# Altium schematic sheet 0095_CONNECTIVITY - GBI.SchDoc
size 848 x 558 mm
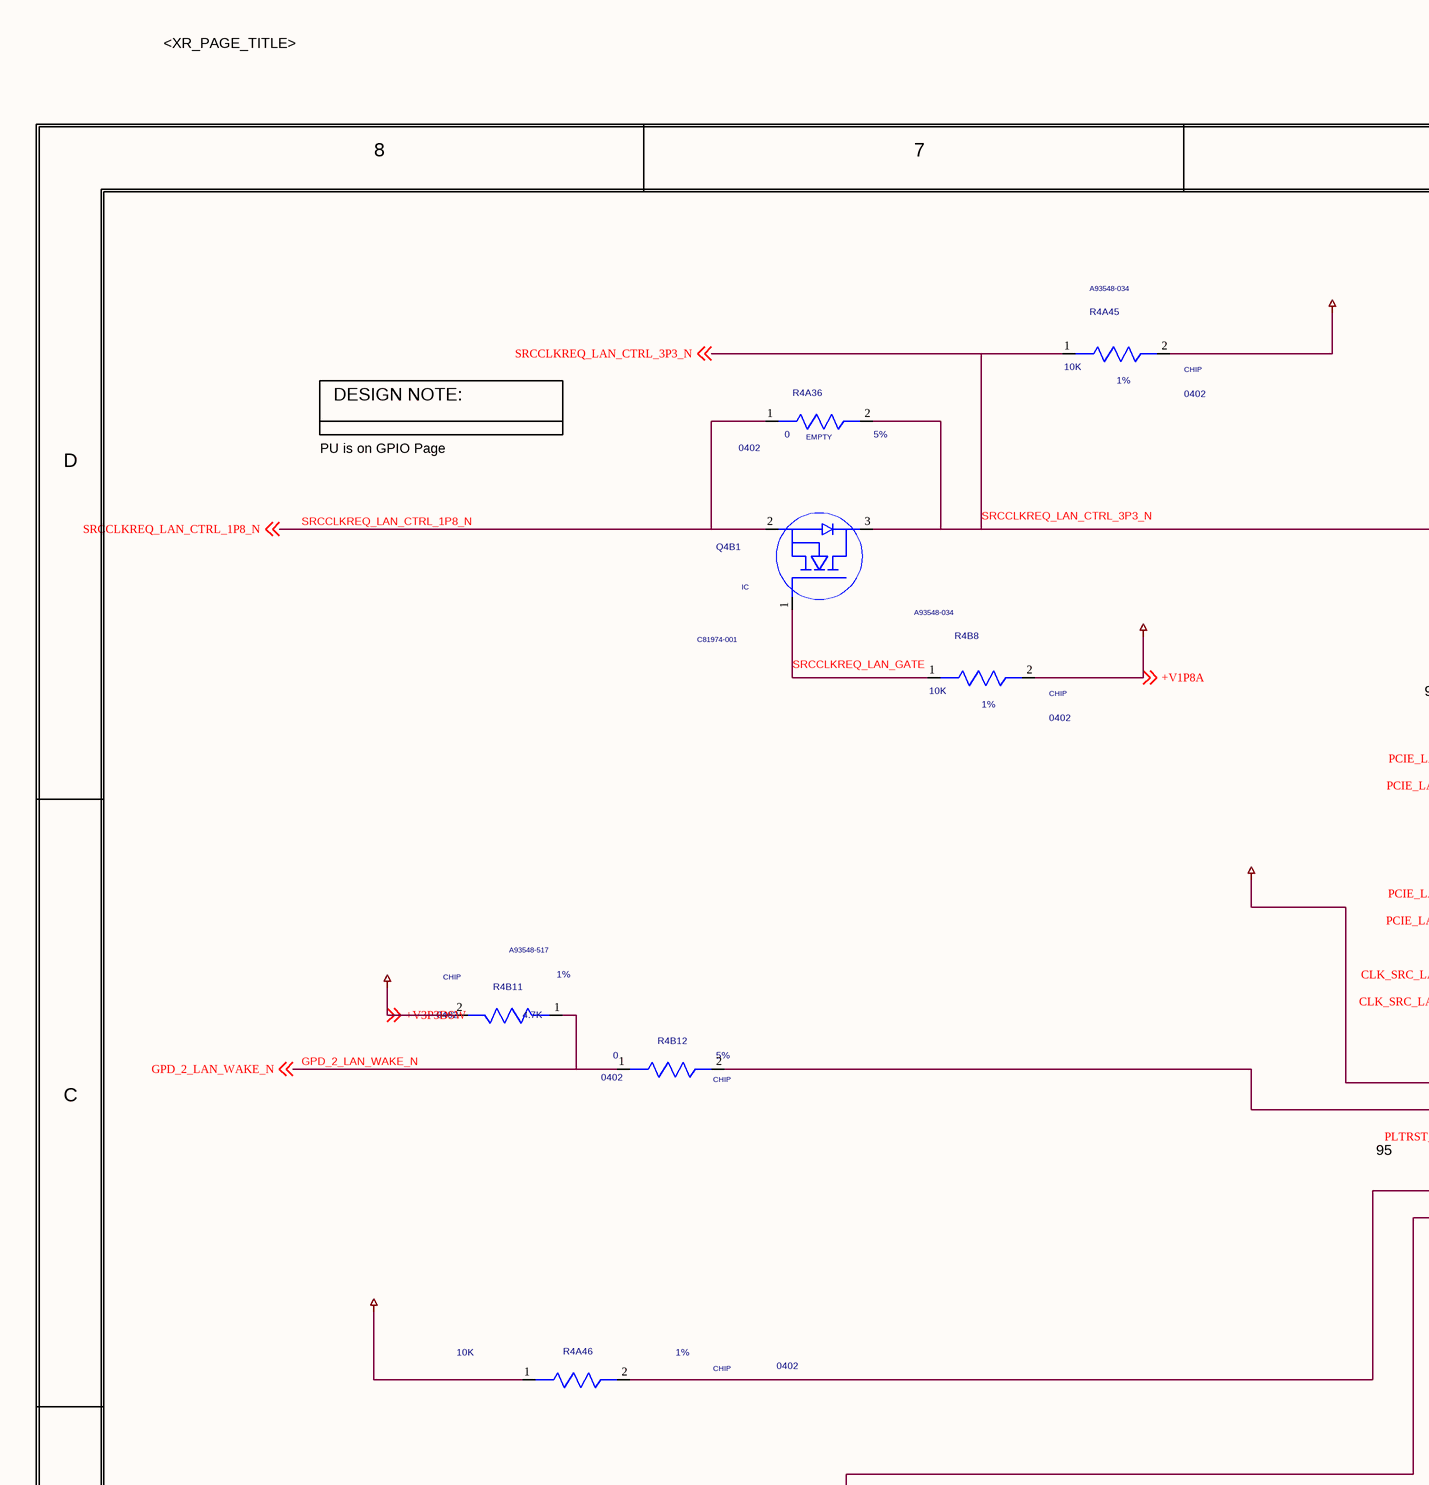
[diagram p0: 0095_CONNECTIVITY - GBI.SchDoc, top left]
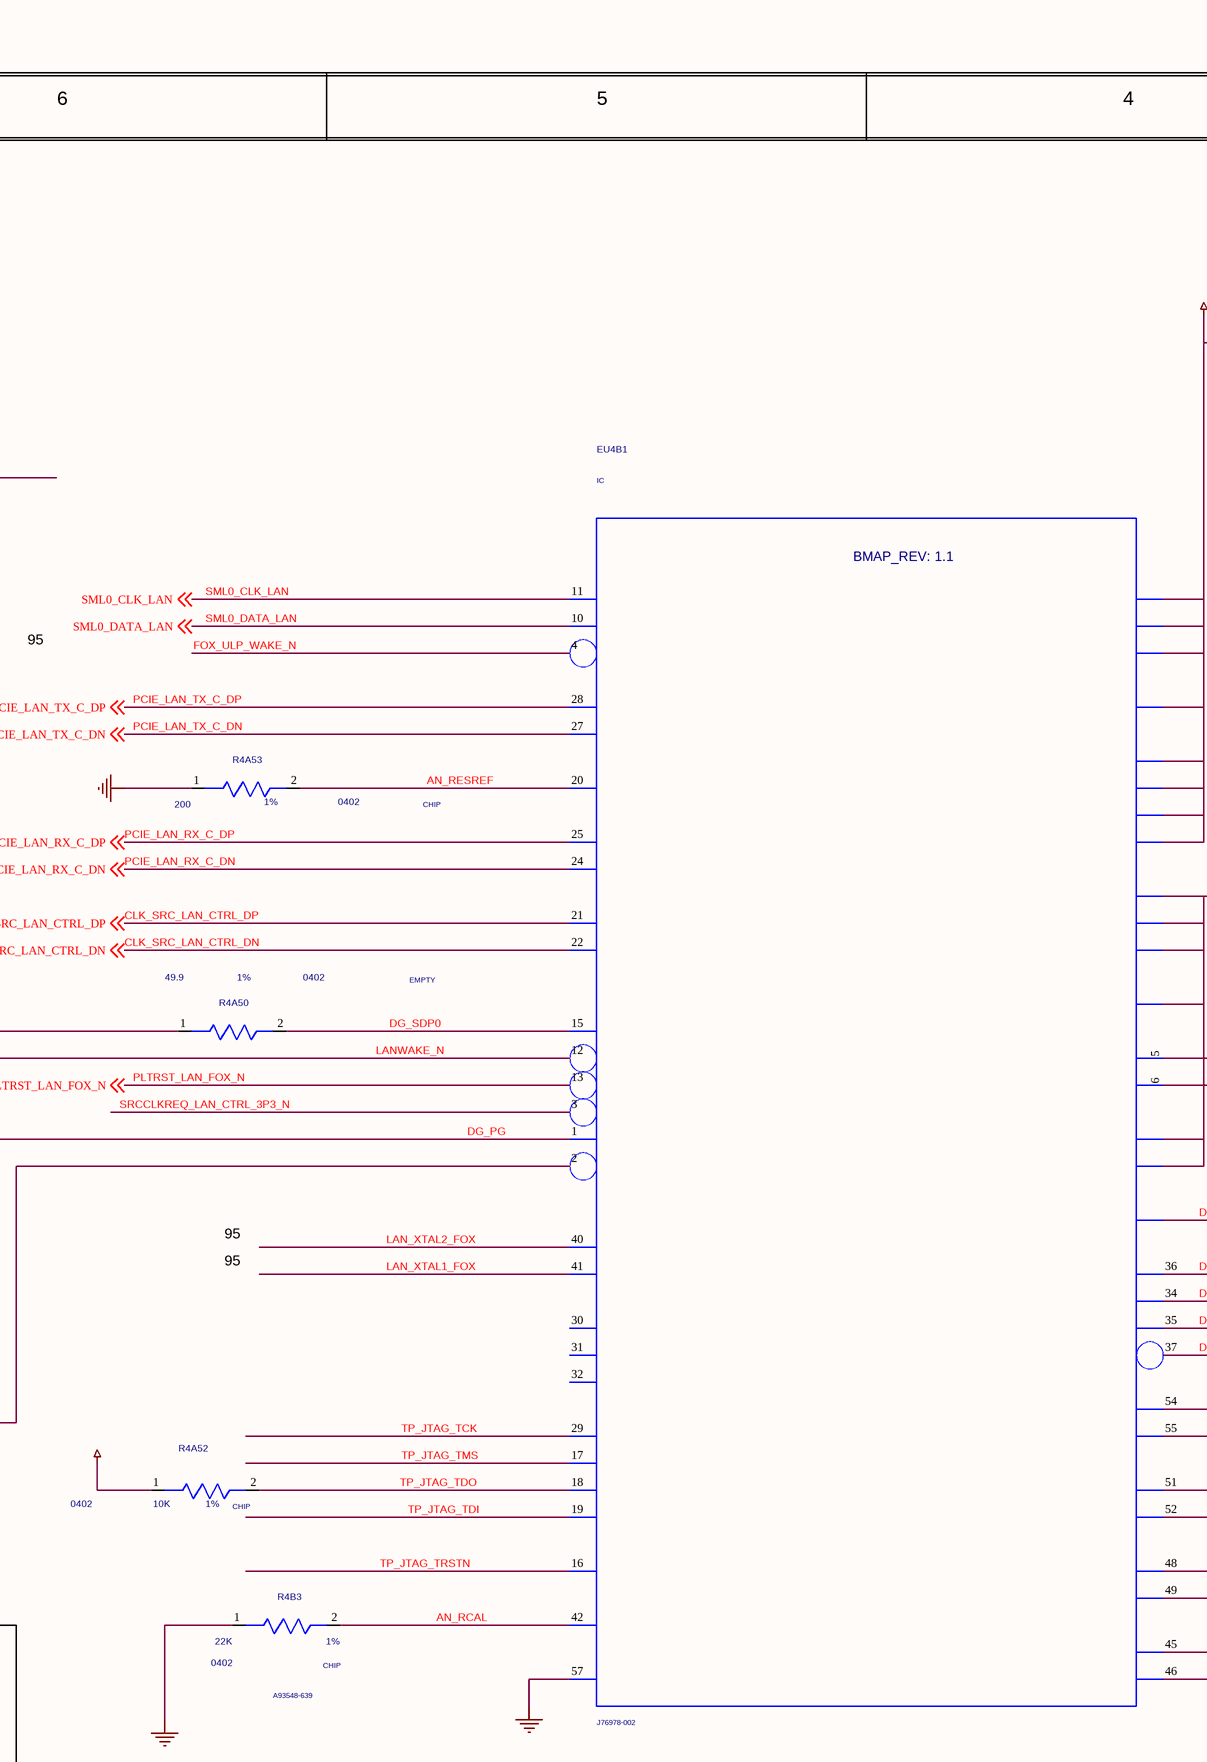
[diagram p1: 0095_CONNECTIVITY - GBI.SchDoc, top middle]
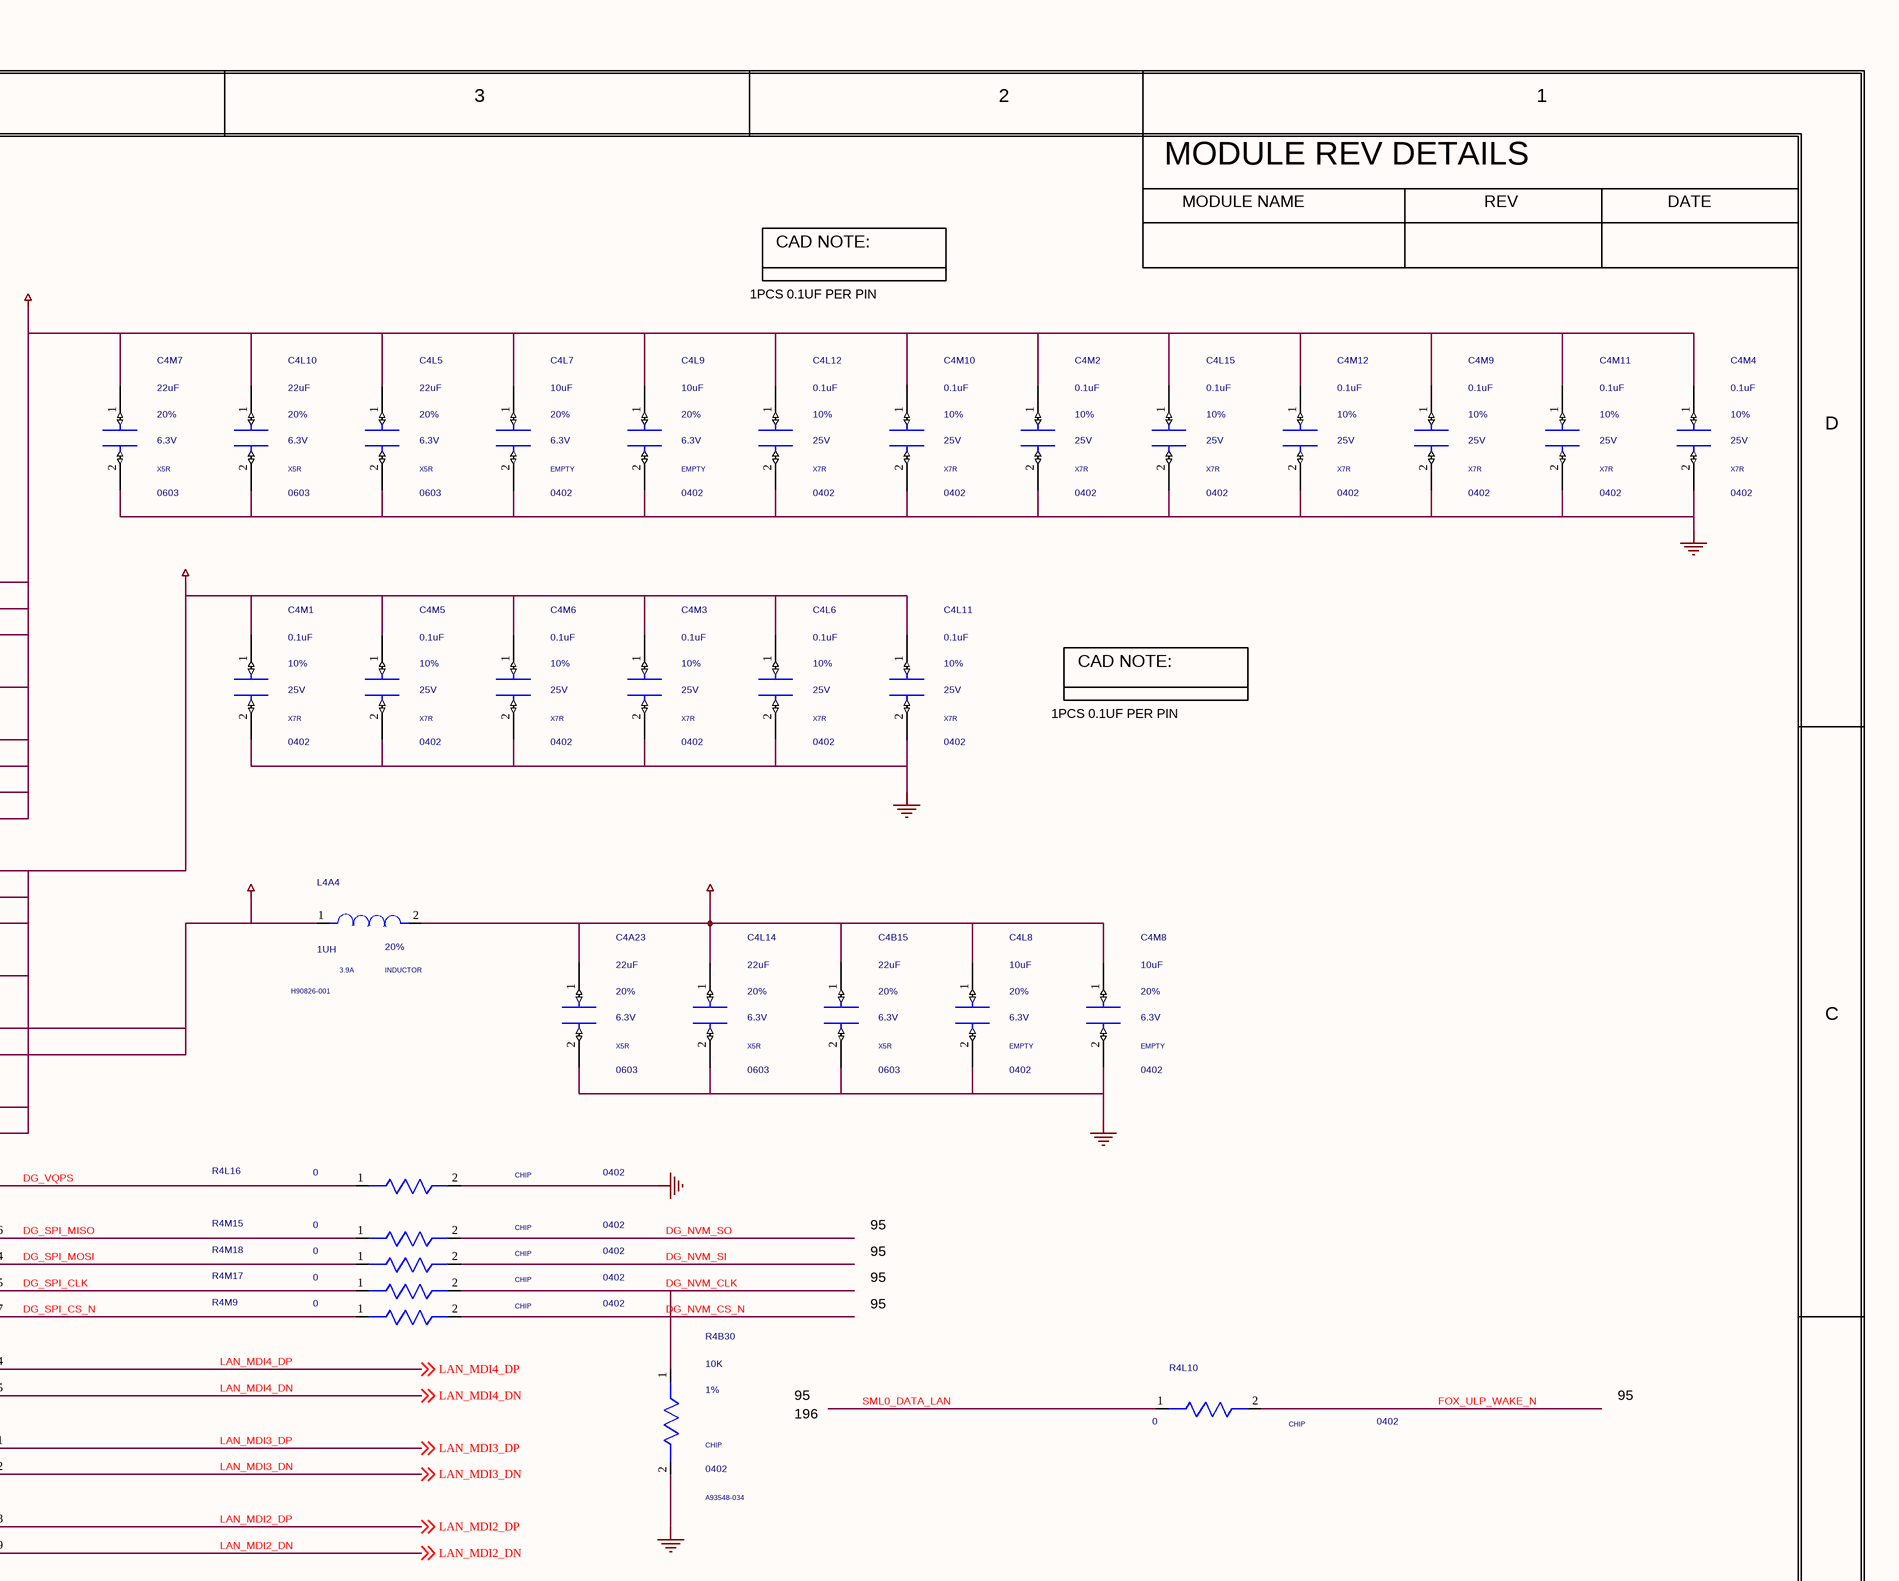
[diagram p2: 0095_CONNECTIVITY - GBI.SchDoc, top right]
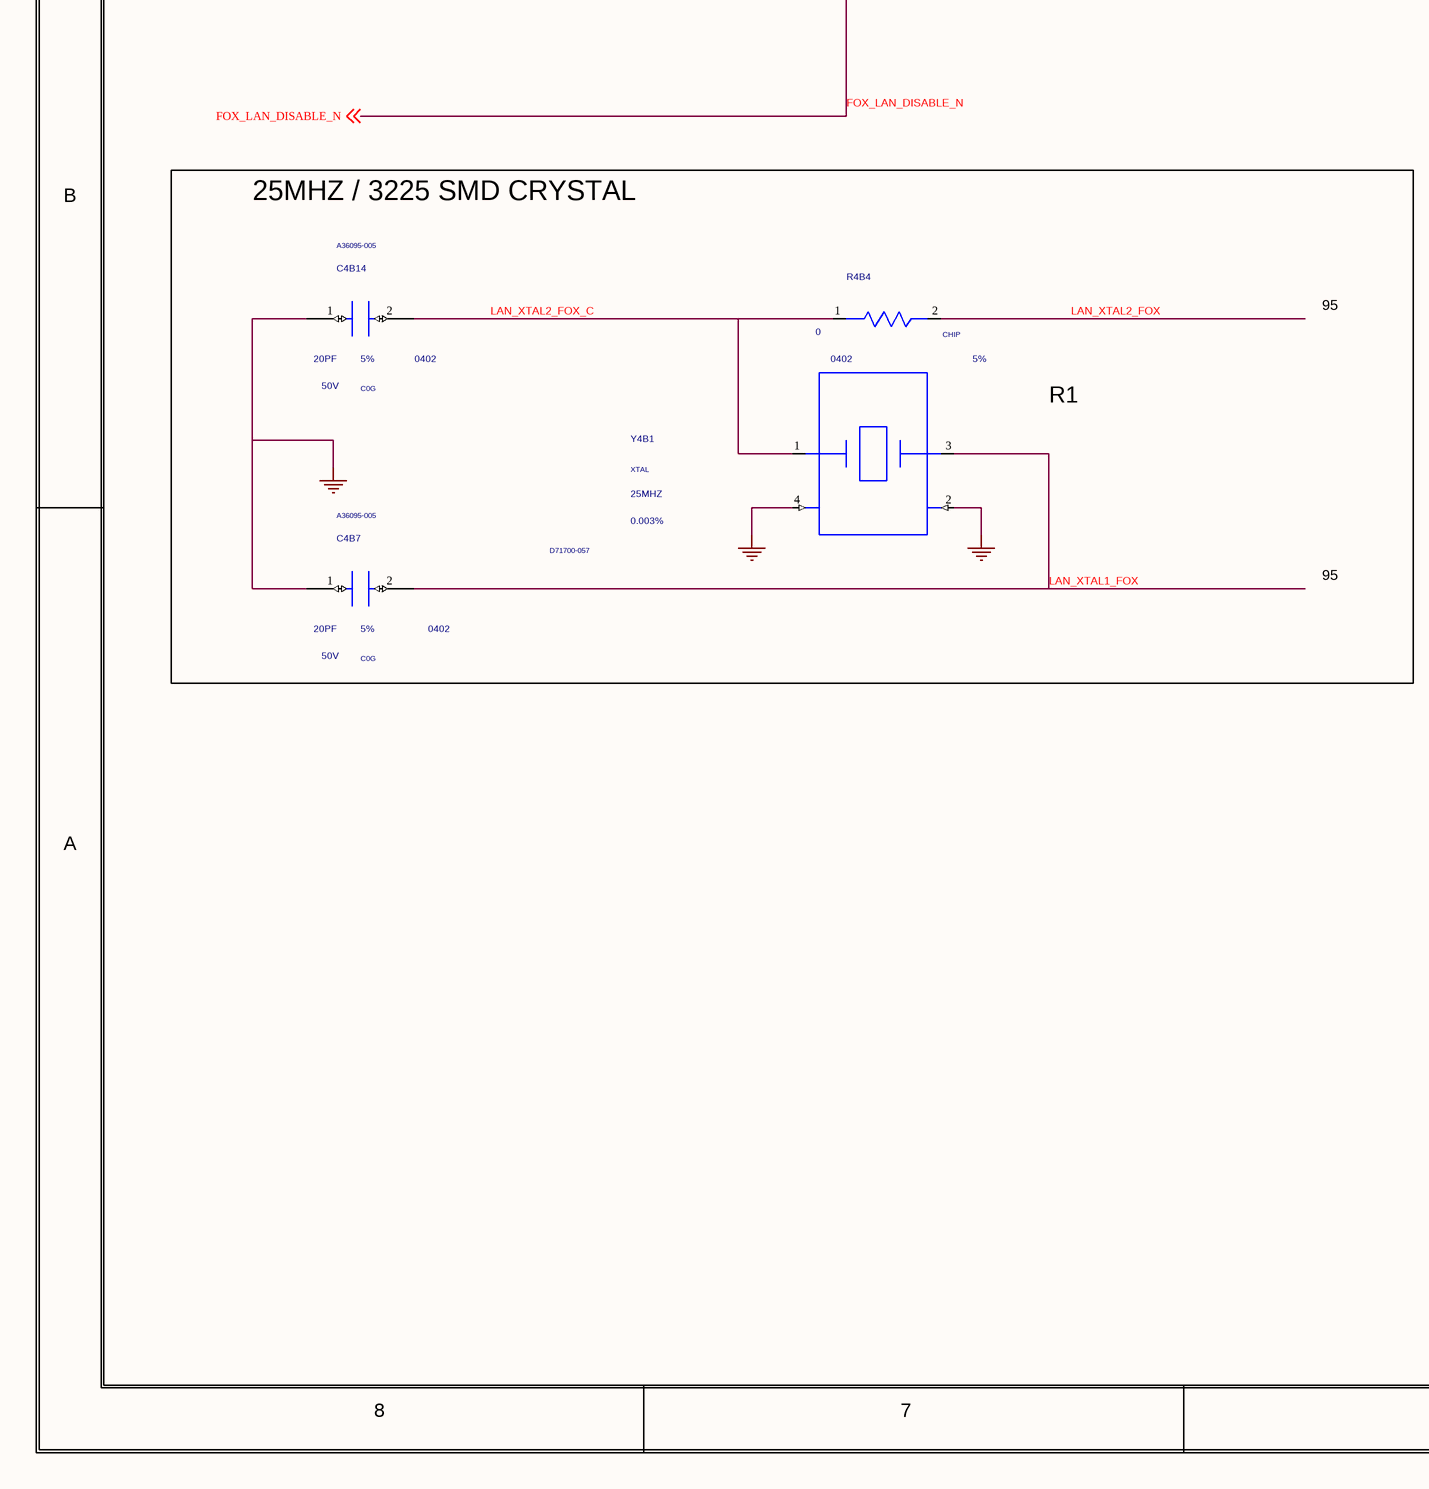
[diagram p3: 0095_CONNECTIVITY - GBI.SchDoc, bottom left]
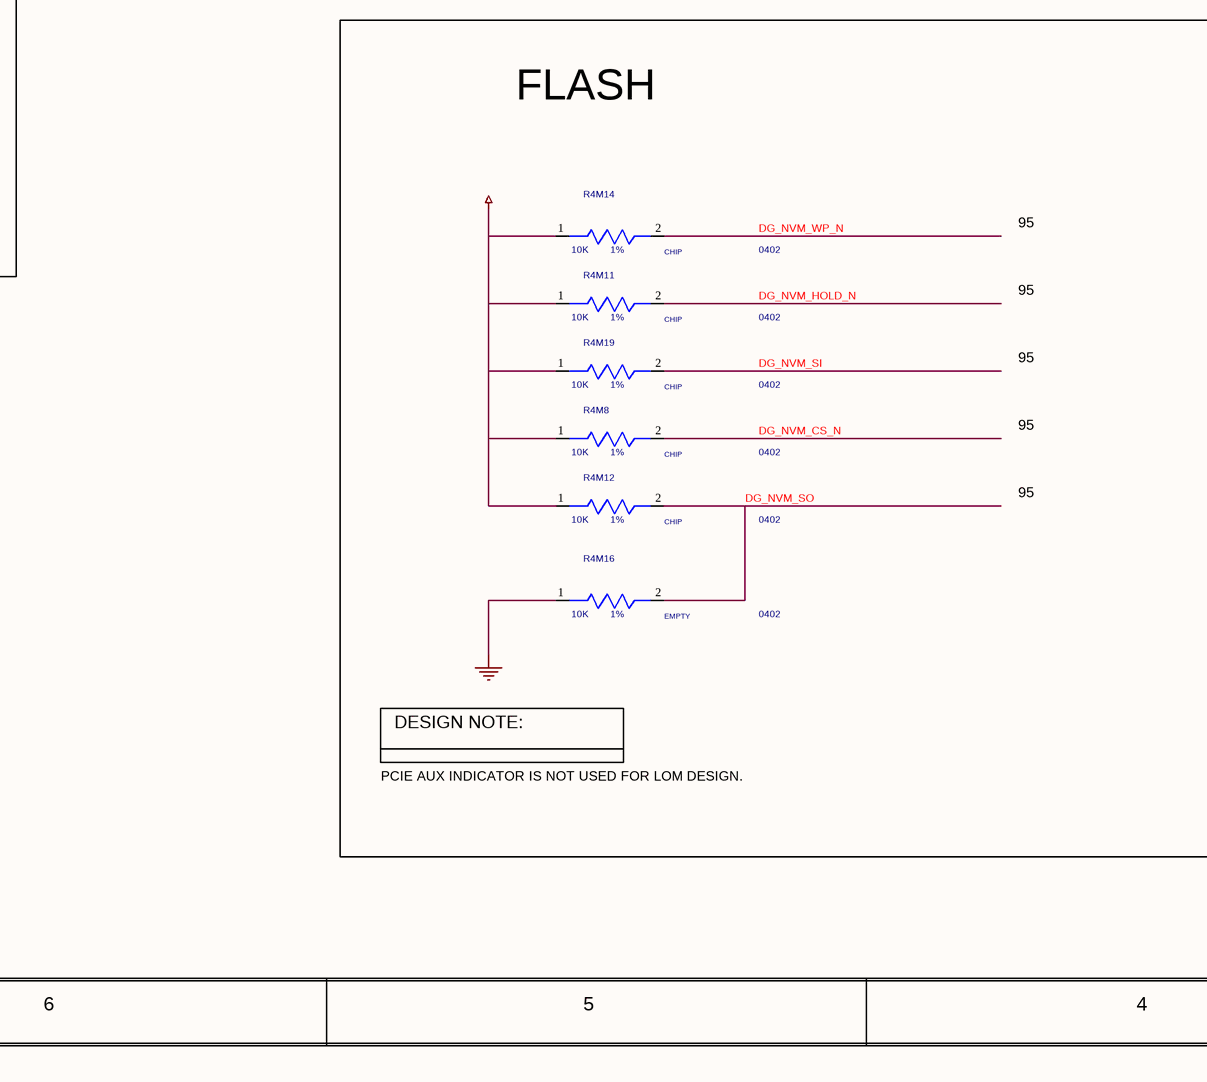
[diagram p4: 0095_CONNECTIVITY - GBI.SchDoc, bottom middle]
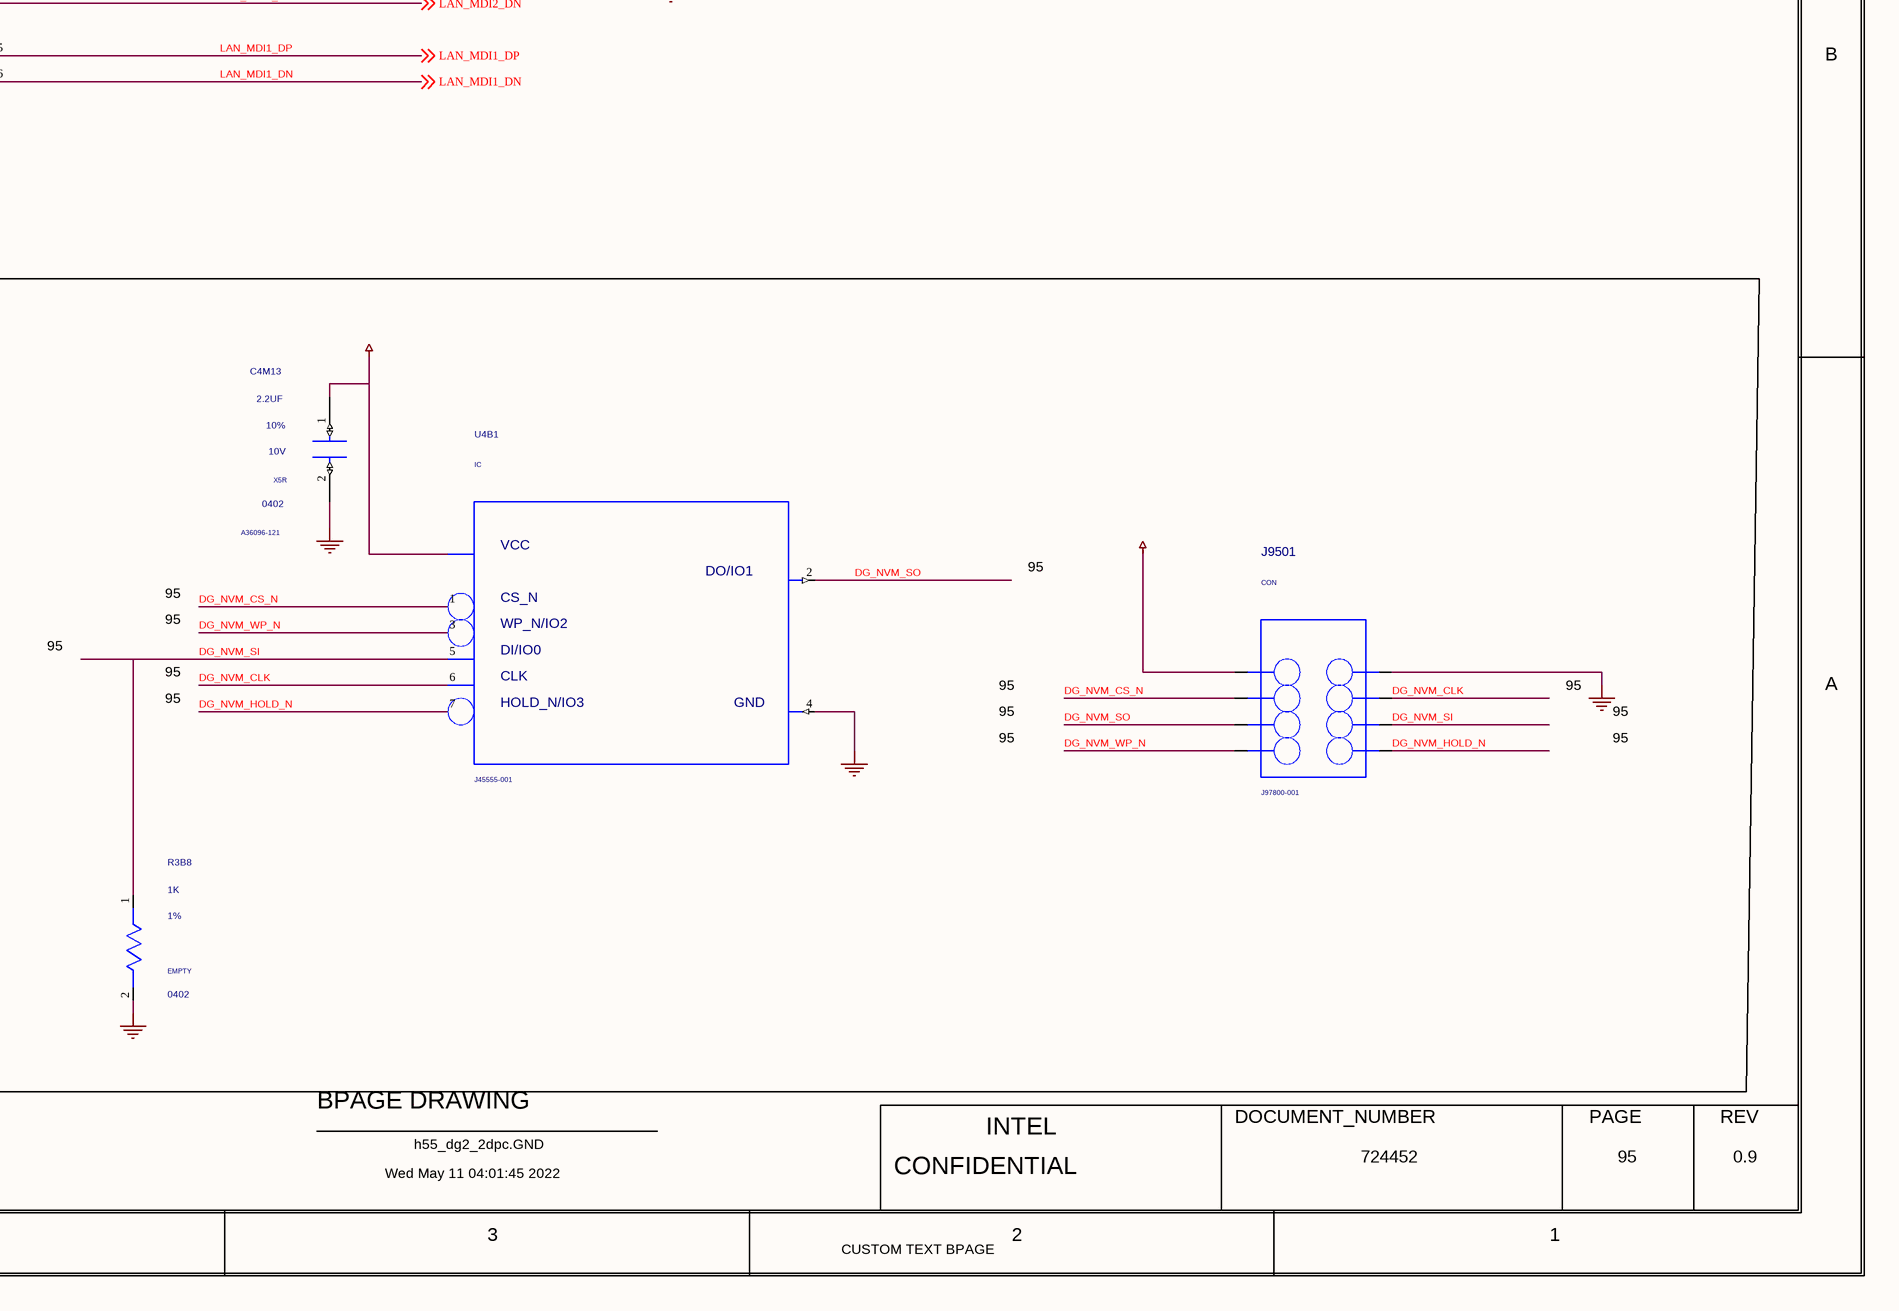
[diagram p5: 0095_CONNECTIVITY - GBI.SchDoc, bottom right]

## Parts
C4A23  22uF  MATERIAL: X5R  PACK_TYPE: 0603  TOLERANCE: 20%  VOLTAGE: 6.3V  [SMC0603ID]
C4B7  20PF  MATERIAL: C0G  PACK_TYPE: 0402  PART_NUMBER: A36095-005  TOLERANCE: 5%  VOLTAGE: 50V  [SMC0402IA]
C4B14  20PF  MATERIAL: C0G  PACK_TYPE: 0402  PART_NUMBER: A36095-005  TOLERANCE: 5%  VOLTAGE: 50V  [SMC0402IA]
C4B15  22uF  MATERIAL: X5R  PACK_TYPE: 0603  TOLERANCE: 20%  VOLTAGE: 6.3V  [SMC0603ID]
C4L5  22uF  MATERIAL: X5R  PACK_TYPE: 0603  TOLERANCE: 20%  VOLTAGE: 6.3V  [SMC0603ID]
C4L6  0.1uF  MATERIAL: X7R  PACK_TYPE: 0402  TOLERANCE: 10%  VOLTAGE: 25V  [SMC0402IA]
C4L7  10uF  MATERIAL: EMPTY  PACK_TYPE: 0402  TOLERANCE: 20%  VOLTAGE: 6.3V  [SMC0402IA]
C4L8  10uF  MATERIAL: EMPTY  PACK_TYPE: 0402  TOLERANCE: 20%  VOLTAGE: 6.3V  [SMC0402IA]
C4L9  10uF  MATERIAL: EMPTY  PACK_TYPE: 0402  TOLERANCE: 20%  VOLTAGE: 6.3V  [SMC0402IA]
C4L10  22uF  MATERIAL: X5R  PACK_TYPE: 0603  TOLERANCE: 20%  VOLTAGE: 6.3V  [SMC0603ID]
C4L11  0.1uF  MATERIAL: X7R  PACK_TYPE: 0402  TOLERANCE: 10%  VOLTAGE: 25V  [SMC0402IA]
C4L12  0.1uF  MATERIAL: X7R  PACK_TYPE: 0402  TOLERANCE: 10%  VOLTAGE: 25V  [SMC0402IA]
C4L14  22uF  MATERIAL: X5R  PACK_TYPE: 0603  TOLERANCE: 20%  VOLTAGE: 6.3V  [SMC0603ID]
C4L15  0.1uF  MATERIAL: X7R  PACK_TYPE: 0402  TOLERANCE: 10%  VOLTAGE: 25V  [SMC0402IA]
C4M1  0.1uF  MATERIAL: X7R  PACK_TYPE: 0402  TOLERANCE: 10%  VOLTAGE: 25V  [SMC0402IA]
C4M2  0.1uF  MATERIAL: X7R  PACK_TYPE: 0402  TOLERANCE: 10%  VOLTAGE: 25V  [SMC0402IA]
C4M3  0.1uF  MATERIAL: X7R  PACK_TYPE: 0402  TOLERANCE: 10%  VOLTAGE: 25V  [SMC0402IA]
C4M4  0.1uF  MATERIAL: X7R  PACK_TYPE: 0402  TOLERANCE: 10%  VOLTAGE: 25V  [SMC0402IA]
C4M5  0.1uF  MATERIAL: X7R  PACK_TYPE: 0402  TOLERANCE: 10%  VOLTAGE: 25V  [SMC0402IA]
C4M6  0.1uF  MATERIAL: X7R  PACK_TYPE: 0402  TOLERANCE: 10%  VOLTAGE: 25V  [SMC0402IA]
C4M7  22uF  MATERIAL: X5R  PACK_TYPE: 0603  TOLERANCE: 20%  VOLTAGE: 6.3V  [SMC0603ID]
C4M8  10uF  MATERIAL: EMPTY  PACK_TYPE: 0402  TOLERANCE: 20%  VOLTAGE: 6.3V  [SMC0402IA]
C4M9  0.1uF  MATERIAL: X7R  PACK_TYPE: 0402  TOLERANCE: 10%  VOLTAGE: 25V  [SMC0402IA]
C4M10  0.1uF  MATERIAL: X7R  PACK_TYPE: 0402  TOLERANCE: 10%  VOLTAGE: 25V  [SMC0402IA]
C4M11  0.1uF  MATERIAL: X7R  PACK_TYPE: 0402  TOLERANCE: 10%  VOLTAGE: 25V  [SMC0402IA]
C4M12  0.1uF  MATERIAL: X7R  PACK_TYPE: 0402  TOLERANCE: 10%  VOLTAGE: 25V  [SMC0402IA]
C4M13  2.2UF  MATERIAL: X5R  PACK_TYPE: 0402  PART_NUMBER: A36096-121  TOLERANCE: 10%  VOLTAGE: 10V  [SMC0402IA]
EU4B1  BMAP_REV: 1.1  MATERIAL: IC  PART_NUMBER: J76978-002  [LCC56_S70_40DFS52MA]  (hidden comment: FOXVILLE_IP)
J9501  MATERIAL: CON  PART_NUMBER: J97800-001  [HDR_SPV_2X4_127MA]  (hidden comment: HDR_2X4)
L4A4  1UH  CURRENT: 3.9A  PART_NUMBER: H90826-001  TOLERANCE: 20%  [SMI22X18MA]
Q4B1  MATERIAL: IC  PART_NUMBER: C81974-001  [SOT23MA]  (hidden comment: FET)
R3B8  1K  MATERIAL: EMPTY  PACK_TYPE: 0402  TOLERANCE: 1%  [SMR0402IA]
R4A36  0  MATERIAL: EMPTY  PACK_TYPE: 0402  TOLERANCE: 5%  [SMR0402IA]
R4A45  10K  MATERIAL: CHIP  PACK_TYPE: 0402  PART_NUMBER: A93548-034  TOLERANCE: 1%  [SMR0402IA]
R4A46  10K  MATERIAL: CHIP  PACK_TYPE: 0402  TOLERANCE: 1%  [SMR0402IA]
R4A50  49.9  MATERIAL: EMPTY  PACK_TYPE: 0402  TOLERANCE: 1%  [SMR0402IA]
R4A52  10K  MATERIAL: CHIP  PACK_TYPE: 0402  TOLERANCE: 1%  [SMR0402IA]
R4A53  200  MATERIAL: CHIP  PACK_TYPE: 0402  TOLERANCE: 1%  [SMR0402IA]
R4B3  22K  MATERIAL: CHIP  PACK_TYPE: 0402  PART_NUMBER: A93548-639  TOLERANCE: 1%  [SMR0402IA]
R4B4  0  MATERIAL: CHIP  PACK_TYPE: 0402  TOLERANCE: 5%  [SMR0402IA]
R4B8  10K  MATERIAL: CHIP  PACK_TYPE: 0402  PART_NUMBER: A93548-034  TOLERANCE: 1%  [SMR0402IA]
R4B11  4.7K  MATERIAL: CHIP  PACK_TYPE: 0402  PART_NUMBER: A93548-517  TOLERANCE: 1%  [SMR0402IA]
R4B12  0  MATERIAL: CHIP  PACK_TYPE: 0402  TOLERANCE: 5%  [SMR0402IA]
R4B30  10K  MATERIAL: CHIP  PACK_TYPE: 0402  PART_NUMBER: A93548-034  TOLERANCE: 1%  [SMR0402IA]
R4L10  0  MATERIAL: CHIP  PACK_TYPE: 0402  [SMR0402IA]
R4L16  0  MATERIAL: CHIP  PACK_TYPE: 0402  [SMR0402IA]
R4M8  10K  MATERIAL: CHIP  PACK_TYPE: 0402  TOLERANCE: 1%  [SMR0402IA]
R4M9  0  MATERIAL: CHIP  PACK_TYPE: 0402  [SMR0402IA]
R4M11  10K  MATERIAL: CHIP  PACK_TYPE: 0402  TOLERANCE: 1%  [SMR0402IA]
R4M12  10K  MATERIAL: CHIP  PACK_TYPE: 0402  TOLERANCE: 1%  [SMR0402IA]
R4M14  10K  MATERIAL: CHIP  PACK_TYPE: 0402  TOLERANCE: 1%  [SMR0402IA]
R4M15  0  MATERIAL: CHIP  PACK_TYPE: 0402  [SMR0402IA]
R4M16  10K  MATERIAL: EMPTY  PACK_TYPE: 0402  TOLERANCE: 1%  [SMR0402IA]
R4M17  0  MATERIAL: CHIP  PACK_TYPE: 0402  [SMR0402IA]
R4M18  0  MATERIAL: CHIP  PACK_TYPE: 0402  [SMR0402IA]
R4M19  10K  MATERIAL: CHIP  PACK_TYPE: 0402  TOLERANCE: 1%  [SMR0402IA]
U4B1  MATERIAL: IC  PART_NUMBER: J45555-001  [SOI8_S52_127MB]  (hidden comment: W25Q16)
Y4B1  25MHZ  MATERIAL: XTAL  PART_NUMBER: D71700-057  TOLERANCE: 0.003%  [SMY4_32X25MA]

## Blocks framed on the sheet
25MHZ / 3225 SMD CRYSTAL: C4B7 C4B14 R4B4 Y4B1
FLASH: C4M13 J9501 R3B8 R4M8 R4M11 R4M12 R4M14 R4M16 R4M19 U4B1

## Nets
+PW_VCC0V9_LAN: C4A23.1(A) C4B15.1(A) C4L6.1(A) C4L8.1(A) C4L11.1(A) C4L14.1(A) C4M1.1(A) C4M3.1(A) C4M5.1(A) C4M6.1(A) C4M8.1(A) L4A4.2(INB)
+PW_VCC0V9_SVR_FOX: EU4B1.5(P0P9V_CTR_1) EU4B1.6(P0P9V_CTR_2) L4A4.1(INA)
+V1P8A: R4B8.2(B) ; off-sheet +V1P8A
+V3P3_LAN: C4L5.1(A) C4L7.1(A) C4L9.1(A) C4L10.1(A) C4L12.1(A) C4L15.1(A) C4M2.1(A) C4M4.1(A) C4M7.1(A) C4M9.1(A) C4M10.1(A) C4M11.1(A) C4M12.1(A) C4M13.1(A) J9501.1(IO1) R4A45.2(B) R4A46.1(A) R4A50.1(A) R4A52.1(A) R4M8.1(A) R4M11.1(A) R4M12.1(A) R4M14.1(A) R4M19.1(A)
+V3P3DSW: R4B11.2(B) ; off-sheet +V3P3DSW
GND: C4A23.2(B) C4B7.1(A) C4B14.1(A) C4B15.2(B) C4L5.2(B) C4L6.2(B) C4L7.2(B) C4L8.2(B) C4L9.2(B) C4L10.2(B) C4L11.2(B) C4L12.2(B) C4L14.2(B) C4L15.2(B) C4M1.2(B) C4M2.2(B) C4M3.2(B) C4M4.2(B) C4M5.2(B) C4M6.2(B) C4M7.2(B) C4M8.2(B) C4M9.2(B) C4M10.2(B) C4M11.2(B) C4M12.2(B) C4M13.2(B) EU4B1.57(THPAD) J9501.2(IO2) R3B8.2(B) R4A53.1(A) R4B3.1(A) R4B30.2(B) R4L16.2(B) R4M16.1(A) U4B1.4(GND) Y4B1.2(GND2) Y4B1.4(GND1)
P0P9V_A_1: EU4B1.44(P0P9V_A_1)
P0P9V_A_2: EU4B1.50(P0P9V_A_2)
P0P9V_A_3: EU4B1.56(P0P9V_A_3)
P0P9V_CORE_1: EU4B1.9(P0P9V_CORE_1)
P0P9V_CORE_2: EU4B1.38(P0P9V_CORE_2)
P0P9V_VP: EU4B1.26(P0P9V_VP)
P3P3V_A_1: EU4B1.47(P3P3V_A_1)
P3P3V_A_2: EU4B1.53(P3P3V_A_2)
P3P3V_CDB: EU4B1.43(P3P3V_CDB)
P3P3V_DC: EU4B1.7(P3P3V_DC)
P3P3V_PAD_1: EU4B1.14(P3P3V_PAD_1)
P3P3V_PAD_2: EU4B1.33(P3P3V_PAD_2)
P3P3V_VPH: EU4B1.23(P3P3V_VPH)
P3P3V_XO: EU4B1.39(P3P3V_XO)
RESERVED: EU4B1.8(RESERVED)
VCC: U4B1.8(VCC)
AN_RCAL: EU4B1.42(PHY_CAL) R4B3.2(B)
AN_RESREF: EU4B1.20(RBIAS) R4A53.2(B)
CLK_SRC_LAN_CTRL_DN: EU4B1.22(PE_CLK_M) ; off-sheet CLK_SRC_LAN_CTRL_DN
CLK_SRC_LAN_CTRL_DP: EU4B1.21(PE_CLK_P) ; off-sheet CLK_SRC_LAN_CTRL_DP
DG_NVM_CLK: J9501.4(IO4) R4B30.1(A) R4M17.2(B) U4B1.6(CLK)
DG_NVM_CS_N: J9501.3(IO3) R4M8.2(B) R4M9.2(B) U4B1.1(CS_N)
DG_NVM_HOLD_N: J9501.8(IO8) R4M11.2(B) U4B1.7(HOLD_N_IO3)
DG_NVM_SI: J9501.6(IO6) R3B8.1(A) R4M18.2(B) R4M19.2(B) U4B1.5(DI_IO0)
DG_NVM_SO: J9501.5(IO5) R4M12.2(B) R4M15.2(B) R4M16.2(B) U4B1.2(DO_IO1)
DG_NVM_WP_N: J9501.7(IO7) R4M14.2(B) U4B1.3(WP_N_IO2)
DG_PG: EU4B1.1(LAN_PWR_GOOD) R4A46.2(B)
DG_SDP0: EU4B1.15(SDP0) R4A50.2(B)
DG_SPI_CLK: EU4B1.35(SPI_CLK) R4M17.1(A)
DG_SPI_CS_N: EU4B1.37(SPI_CS_N) R4M9.1(A)
DG_SPI_MISO: EU4B1.36(SPI_DIN_AUX_PWR) R4M15.1(A)
DG_SPI_MOSI: EU4B1.34(SPI_DOUT) R4M18.1(A)
DG_VQPS: R4L16.1(A)
FOX_LAN_DISABLE_N: EU4B1.2(LAN_DISABLE_N) ; off-sheet FOX_LAN_DISABLE_N
FOX_ULP_WAKE_N: EU4B1.4(ULP_WAKE_N) R4L10.2(B)
GPD_2_LAN_WAKE_N: R4B11.1(A) R4B12.1(A) ; off-sheet GPD_2_LAN_WAKE_N
LAN_MDI1_DN: EU4B1.46(MDI_A_M) ; off-sheet LAN_MDI1_DN
LAN_MDI1_DP: EU4B1.45(MDI_A_P) ; off-sheet LAN_MDI1_DP
LAN_MDI2_DN: EU4B1.49(MDI_B_M) ; off-sheet LAN_MDI2_DN
LAN_MDI2_DP: EU4B1.48(MDI_B_P) ; off-sheet LAN_MDI2_DP
LAN_MDI3_DN: EU4B1.52(MDI_C_M) ; off-sheet LAN_MDI3_DN
LAN_MDI3_DP: EU4B1.51(MDI_C_P) ; off-sheet LAN_MDI3_DP
LAN_MDI4_DN: EU4B1.55(MDI_D_M) ; off-sheet LAN_MDI4_DN
LAN_MDI4_DP: EU4B1.54(MDI_D_P) ; off-sheet LAN_MDI4_DP
LAN_XTAL1_FOX: C4B7.2(B) EU4B1.41(XTAL_IN) Y4B1.3(A2)
LAN_XTAL2_FOX: EU4B1.40(XTAL_OUT) R4B4.2(B)
LAN_XTAL2_FOX_C: C4B14.2(B) R4B4.1(A) Y4B1.1(A1)
LANWAKE_N: EU4B1.12(PE_WAKE_N) R4B12.2(B)
PCIE_LAN_RX_C_DN: EU4B1.24(PE_TX_M) ; off-sheet PCIE_LAN_RX_C_DN
PCIE_LAN_RX_C_DP: EU4B1.25(PE_TX_P) ; off-sheet PCIE_LAN_RX_C_DP
PCIE_LAN_TX_C_DN: EU4B1.27(PE_RX_M) ; off-sheet PCIE_LAN_TX_C_DN
PCIE_LAN_TX_C_DP: EU4B1.28(PE_RX_P) ; off-sheet PCIE_LAN_TX_C_DP
PLTRST_LAN_FOX_N: EU4B1.13(PE_RST_N) ; off-sheet PLTRST_LAN_FOX_N
SML0_CLK_LAN: EU4B1.11(SMB_CLK) ; off-sheet SML0_CLK_LAN
SML0_DATA_LAN: EU4B1.10(SMB_DATA) R4L10.1(A) ; off-sheet SML0_DATA_LAN
SRCCLKREQ_LAN_CTRL_1P8_N: Q4B1.2(S) R4A36.1(A) ; off-sheet SRCCLKREQ_LAN_CTRL_1P8_N
SRCCLKREQ_LAN_CTRL_3P3_N: EU4B1.3(PE_CLKREQ_N) Q4B1.3(D) R4A36.2(B) R4A45.1(A) ; off-sheet SRCCLKREQ_LAN_CTRL_3P3_N
SRCCLKREQ_LAN_GATE: Q4B1.1(G) R4B8.1(A)
TP_JTAG_TCK: EU4B1.29(JTAG_CLK)
TP_JTAG_TDI: EU4B1.19(JTAG_TDI_SDP1)
TP_JTAG_TDO: EU4B1.18(JTAG_TDO__MDI_LANE_SWAP) R4A52.2(B)
TP_JTAG_TMS: EU4B1.17(JTAG_TMS_SDP2)
TP_JTAG_TRSTN: EU4B1.16(JTAG_RST)

Not connected (* = marked no-connect by the designer): EU4B1 30(LED2) 31(LED1) 32(LED0)

## Notes on the sheet
- <XR_PAGE_TITLE>
- 8
- 7
- 6
- 5
- 4
- 3
- 2
- 1
- MODULE REV DETAILS
- CAD NOTE:
- MODULE NAME
- REV
- DATE
- 1PCS 0.1UF PER PIN
- PU is on GPIO Page
- DESIGN NOTE:
- D
- 95
- C
- 196
- B
- R1
- A
- PCIE AUX INDICATOR IS NOT USED FOR LOM DESIGN.
- BPAGE DRAWING
- INTEL
- DOCUMENT_NUMBER
- PAGE
- Wed May 11 04:01:45 2022
- h55_dg2_2dpc.GND
- CONFIDENTIAL
- 724452
- 0.9
- CUSTOM TEXT BPAGE
- (in symbol W25Q16) DO/IO1; WP_N/IO2; DI/IO0; HOLD_N/IO3

## Library data of the parts
C4A23 = CAP: PART_NUMBER: 602433-081; CDS_PHYS_PART_NAME: CAP_0603-602433-081,X5R,22UF,6.3V,20%,LPDB,GENERIC; OriginalSymbolOrigin: (-50,25); XY: (-3900,3600); VER: 1; ROT: 0; PHYS_PAGE: 95; LOCATION: C4A23; IP: GENERIC; FP_TECH: LPDB; DRAWING: @RVP1_ADL_SB_ADP_S_DDR5_SODIMM_2DPC_LIB.H55_DG2_2DPC(SCH_1):PAGE466; CDS_LIB: discrete; PCB Footprint: SMC0603ID; CHIPS_PART_NAME: CAP; CDS_PART_NAME: CAP_0603-602433-081,X5R,22UF,6.3V,20%,LPDB,GENERIC; CDS_LOCATION: C4A23
C4B7 = CAP#1: CHIPS_PART_NAME: CAP; CDS_PHYS_PART_NAME: CAP_0402-A36095-005,C0G,20PF,50V,5%,LPDB,GENERIC; OriginalSymbolOrigin: (-25,50); XY: (-9100,1750); VER: 2; ROT: 0; PHYS_PAGE: 95; LOCATION: C4B7; IP: GENERIC; FP_TECH: LPDB; DRAWING: @RVP1_ADL_SB_ADP_S_DDR5_SODIMM_2DPC_LIB.H55_DG2_2DPC(SCH_1):PAGE466; CDS_LIB: discrete; PCB Footprint: SMC0402IA; CDS_PART_NAME: CAP_0402-A36095-005,C0G,20PF,50V,5%,LPDB,GENERIC; CDS_LOCATION: C4B7
C4B14 = CAP#1: CHIPS_PART_NAME: CAP; CDS_PHYS_PART_NAME: CAP_0402-A36095-005,C0G,20PF,50V,5%,LPDB,GENERIC; OriginalSymbolOrigin: (-25,50); XY: (-9100,2250); VER: 2; ROT: 0; PHYS_PAGE: 95; LOCATION: C4B14; IP: GENERIC; FP_TECH: LPDB; DRAWING: @RVP1_ADL_SB_ADP_S_DDR5_SODIMM_2DPC_LIB.H55_DG2_2DPC(SCH_1):PAGE466; CDS_LIB: discrete; PCB Footprint: SMC0402IA; CDS_PART_NAME: CAP_0402-A36095-005,C0G,20PF,50V,5%,LPDB,GENERIC; CDS_LOCATION: C4B14
C4B15 = CAP: PART_NUMBER: 602433-081; CDS_PHYS_PART_NAME: CAP_0603-602433-081,X5R,22UF,6.3V,20%,LPDB,GENERIC; OriginalSymbolOrigin: (-50,25); XY: (-3400,3600); VER: 1; ROT: 0; PHYS_PAGE: 95; LOCATION: C4B15; IP: GENERIC; FP_TECH: LPDB; DRAWING: @RVP1_ADL_SB_ADP_S_DDR5_SODIMM_2DPC_LIB.H55_DG2_2DPC(SCH_1):PAGE466; CDS_LIB: discrete; PCB Footprint: SMC0603ID; CHIPS_PART_NAME: CAP; CDS_PART_NAME: CAP_0603-602433-081,X5R,22UF,6.3V,20%,LPDB,GENERIC; CDS_LOCATION: C4B15
C4L5 = CAP: PART_NUMBER: 602433-081; CDS_PHYS_PART_NAME: CAP_0603-602433-081,X5R,22UF,6.3V,20%,LPDB,GENERIC; OriginalSymbolOrigin: (-50,25); XY: (-4275,4700); VER: 1; ROT: 0; PHYS_PAGE: 95; LOCATION: C4L5; IP: GENERIC; FP_TECH: LPDB; DRAWING: @RVP1_ADL_SB_ADP_S_DDR5_SODIMM_2DPC_LIB.H55_DG2_2DPC(SCH_1):PAGE466; CDS_LIB: discrete; PCB Footprint: SMC0603ID; CHIPS_PART_NAME: CAP; CDS_PART_NAME: CAP_0603-602433-081,X5R,22UF,6.3V,20%,LPDB,GENERIC; CDS_LOCATION: C4L5
C4L6 = CAP: PART_NUMBER: A36096-112; CDS_PHYS_PART_NAME: CAP_0402-A36096-112,X7R,0.1UF,25V,10%,LPDB,GENERIC; OriginalSymbolOrigin: (-50,25); XY: (-3525,4225); VER: 1; ROT: 0; PHYS_PAGE: 95; LOCATION: C4L6; IP: GENERIC; FP_TECH: LPDB; DRAWING: @RVP1_ADL_SB_ADP_S_DDR5_SODIMM_2DPC_LIB.H55_DG2_2DPC(SCH_1):PAGE466; CDS_LIB: discrete; PCB Footprint: SMC0402IA; CHIPS_PART_NAME: CAP; CDS_PART_NAME: CAP_0402-A36096-112,X7R,0.1UF,25V,10%,LPDB,GENERIC; CDS_LOCATION: C4L6
C4L7 = CAP: PART_NUMBER: A36096-114; CDS_PHYS_PART_NAME: CAP_0402-A36096-114,EMPTY,10UF,6.3V,20%,LPDB,GENERIC; OriginalSymbolOrigin: (-50,25); XY: (-4025,4700); VER: 1; ROT: 0; PHYS_PAGE: 95; LOCATION: C4L7; IP: GENERIC; FP_TECH: LPDB; DRAWING: @RVP1_ADL_SB_ADP_S_DDR5_SODIMM_2DPC_LIB.H55_DG2_2DPC(SCH_1):PAGE466; CDS_LIB: discrete; PCB Footprint: SMC0402IA; CHIPS_PART_NAME: CAP; CDS_PART_NAME: CAP_0402-A36096-114,EMPTY,10UF,6.3V,20%,LPDB,GENERIC; CDS_LOCATION: C4L7
C4L8 = CAP: PART_NUMBER: A36096-114; CDS_PHYS_PART_NAME: CAP_0402-A36096-114,EMPTY,10UF,6.3V,20%,LPDB,GENERIC; OriginalSymbolOrigin: (-50,25); XY: (-3150,3600); VER: 1; ROT: 0; PHYS_PAGE: 95; LOCATION: C4L8; IP: GENERIC; FP_TECH: LPDB; DRAWING: @RVP1_ADL_SB_ADP_S_DDR5_SODIMM_2DPC_LIB.H55_DG2_2DPC(SCH_1):PAGE466; CDS_LIB: discrete; PCB Footprint: SMC0402IA; CHIPS_PART_NAME: CAP; CDS_PART_NAME: CAP_0402-A36096-114,EMPTY,10UF,6.3V,20%,LPDB,GENERIC; CDS_LOCATION: C4L8
C4L9 = CAP: PART_NUMBER: A36096-114; CDS_PHYS_PART_NAME: CAP_0402-A36096-114,EMPTY,10UF,6.3V,20%,LPDB,GENERIC; OriginalSymbolOrigin: (-50,25); XY: (-3775,4700); VER: 1; ROT: 0; PHYS_PAGE: 95; LOCATION: C4L9; IP: GENERIC; FP_TECH: LPDB; DRAWING: @RVP1_ADL_SB_ADP_S_DDR5_SODIMM_2DPC_LIB.H55_DG2_2DPC(SCH_1):PAGE466; CDS_LIB: discrete; PCB Footprint: SMC0402IA; CHIPS_PART_NAME: CAP; CDS_PART_NAME: CAP_0402-A36096-114,EMPTY,10UF,6.3V,20%,LPDB,GENERIC; CDS_LOCATION: C4L9
C4L10 = CAP: PART_NUMBER: 602433-081; CDS_PHYS_PART_NAME: CAP_0603-602433-081,X5R,22UF,6.3V,20%,LPDB,GENERIC; OriginalSymbolOrigin: (-50,25); XY: (-4525,4700); VER: 1; ROT: 0; PHYS_PAGE: 95; LOCATION: C4L10; IP: GENERIC; FP_TECH: LPDB; DRAWING: @RVP1_ADL_SB_ADP_S_DDR5_SODIMM_2DPC_LIB.H55_DG2_2DPC(SCH_1):PAGE466; CDS_LIB: discrete; PCB Footprint: SMC0603ID; CHIPS_PART_NAME: CAP; CDS_PART_NAME: CAP_0603-602433-081,X5R,22UF,6.3V,20%,LPDB,GENERIC; CDS_LOCATION: C4L10
C4L11 = CAP: PART_NUMBER: A36096-112; CDS_PHYS_PART_NAME: CAP_0402-A36096-112,X7R,0.1UF,25V,10%,LPDB,GENERIC; OriginalSymbolOrigin: (-50,25); XY: (-3275,4225); VER: 1; ROT: 0; PHYS_PAGE: 95; LOCATION: C4L11; IP: GENERIC; FP_TECH: LPDB; DRAWING: @RVP1_ADL_SB_ADP_S_DDR5_SODIMM_2DPC_LIB.H55_DG2_2DPC(SCH_1):PAGE466; CDS_LIB: discrete; PCB Footprint: SMC0402IA; CHIPS_PART_NAME: CAP; CDS_PART_NAME: CAP_0402-A36096-112,X7R,0.1UF,25V,10%,LPDB,GENERIC; CDS_LOCATION: C4L11
C4L12 = CAP: PART_NUMBER: A36096-112; CDS_PHYS_PART_NAME: CAP_0402-A36096-112,X7R,0.1UF,25V,10%,LPDB,GENERIC; OriginalSymbolOrigin: (-50,25); XY: (-3525,4700); VER: 1; ROT: 0; PHYS_PAGE: 95; LOCATION: C4L12; IP: GENERIC; FP_TECH: LPDB; DRAWING: @RVP1_ADL_SB_ADP_S_DDR5_SODIMM_2DPC_LIB.H55_DG2_2DPC(SCH_1):PAGE466; CDS_LIB: discrete; PCB Footprint: SMC0402IA; CHIPS_PART_NAME: CAP; CDS_PART_NAME: CAP_0402-A36096-112,X7R,0.1UF,25V,10%,LPDB,GENERIC; CDS_LOCATION: C4L12
C4L14 = CAP: PART_NUMBER: 602433-081; CDS_PHYS_PART_NAME: CAP_0603-602433-081,X5R,22UF,6.3V,20%,LPDB,GENERIC; OriginalSymbolOrigin: (-50,25); XY: (-3650,3600); VER: 1; ROT: 0; PHYS_PAGE: 95; LOCATION: C4L14; IP: GENERIC; FP_TECH: LPDB; DRAWING: @RVP1_ADL_SB_ADP_S_DDR5_SODIMM_2DPC_LIB.H55_DG2_2DPC(SCH_1):PAGE466; CDS_LIB: discrete; PCB Footprint: SMC0603ID; CHIPS_PART_NAME: CAP; CDS_PART_NAME: CAP_0603-602433-081,X5R,22UF,6.3V,20%,LPDB,GENERIC; CDS_LOCATION: C4L14
C4L15 = CAP: PART_NUMBER: A36096-112; CDS_PHYS_PART_NAME: CAP_0402-A36096-112,X7R,0.1UF,25V,10%,LPDB,GENERIC; OriginalSymbolOrigin: (-50,25); XY: (-2775,4700); VER: 1; ROT: 0; PHYS_PAGE: 95; LOCATION: C4L15; IP: GENERIC; FP_TECH: LPDB; DRAWING: @RVP1_ADL_SB_ADP_S_DDR5_SODIMM_2DPC_LIB.H55_DG2_2DPC(SCH_1):PAGE466; CDS_LIB: discrete; PCB Footprint: SMC0402IA; CHIPS_PART_NAME: CAP; CDS_PART_NAME: CAP_0402-A36096-112,X7R,0.1UF,25V,10%,LPDB,GENERIC; CDS_LOCATION: C4L15
C4M1 = CAP: PART_NUMBER: A36096-112; CDS_PHYS_PART_NAME: CAP_0402-A36096-112,X7R,0.1UF,25V,10%,LPDB,GENERIC; OriginalSymbolOrigin: (-50,25); XY: (-4525,4225); VER: 1; ROT: 0; PHYS_PAGE: 95; LOCATION: C4M1; IP: GENERIC; FP_TECH: LPDB; DRAWING: @RVP1_ADL_SB_ADP_S_DDR5_SODIMM_2DPC_LIB.H55_DG2_2DPC(SCH_1):PAGE466; CDS_LIB: discrete; PCB Footprint: SMC0402IA; CHIPS_PART_NAME: CAP; CDS_PART_NAME: CAP_0402-A36096-112,X7R,0.1UF,25V,10%,LPDB,GENERIC; CDS_LOCATION: C4M1
C4M2 = CAP: PART_NUMBER: A36096-112; CDS_PHYS_PART_NAME: CAP_0402-A36096-112,X7R,0.1UF,25V,10%,LPDB,GENERIC; OriginalSymbolOrigin: (-50,25); XY: (-3025,4700); VER: 1; ROT: 0; PHYS_PAGE: 95; LOCATION: C4M2; IP: GENERIC; FP_TECH: LPDB; DRAWING: @RVP1_ADL_SB_ADP_S_DDR5_SODIMM_2DPC_LIB.H55_DG2_2DPC(SCH_1):PAGE466; CDS_LIB: discrete; PCB Footprint: SMC0402IA; CHIPS_PART_NAME: CAP; CDS_PART_NAME: CAP_0402-A36096-112,X7R,0.1UF,25V,10%,LPDB,GENERIC; CDS_LOCATION: C4M2
C4M3 = CAP: PART_NUMBER: A36096-112; CDS_PHYS_PART_NAME: CAP_0402-A36096-112,X7R,0.1UF,25V,10%,LPDB,GENERIC; OriginalSymbolOrigin: (-50,25); XY: (-3775,4225); VER: 1; ROT: 0; PHYS_PAGE: 95; LOCATION: C4M3; IP: GENERIC; FP_TECH: LPDB; DRAWING: @RVP1_ADL_SB_ADP_S_DDR5_SODIMM_2DPC_LIB.H55_DG2_2DPC(SCH_1):PAGE466; CDS_LIB: discrete; PCB Footprint: SMC0402IA; CHIPS_PART_NAME: CAP; CDS_PART_NAME: CAP_0402-A36096-112,X7R,0.1UF,25V,10%,LPDB,GENERIC; CDS_LOCATION: C4M3
C4M4 = CAP: PART_NUMBER: A36096-112; CDS_PHYS_PART_NAME: CAP_0402-A36096-112,X7R,0.1UF,25V,10%,LPDB,GENERIC; OriginalSymbolOrigin: (-50,25); XY: (-1775,4700); VER: 1; ROT: 0; PHYS_PAGE: 95; LOCATION: C4M4; IP: GENERIC; FP_TECH: LPDB; DRAWING: @RVP1_ADL_SB_ADP_S_DDR5_SODIMM_2DPC_LIB.H55_DG2_2DPC(SCH_1):PAGE466; CDS_LIB: discrete; PCB Footprint: SMC0402IA; CHIPS_PART_NAME: CAP; CDS_PART_NAME: CAP_0402-A36096-112,X7R,0.1UF,25V,10%,LPDB,GENERIC; CDS_LOCATION: C4M4
C4M5 = CAP: PART_NUMBER: A36096-112; CDS_PHYS_PART_NAME: CAP_0402-A36096-112,X7R,0.1UF,25V,10%,LPDB,GENERIC; OriginalSymbolOrigin: (-50,25); XY: (-4275,4225); VER: 1; ROT: 0; PHYS_PAGE: 95; LOCATION: C4M5; IP: GENERIC; FP_TECH: LPDB; DRAWING: @RVP1_ADL_SB_ADP_S_DDR5_SODIMM_2DPC_LIB.H55_DG2_2DPC(SCH_1):PAGE466; CDS_LIB: discrete; PCB Footprint: SMC0402IA; CHIPS_PART_NAME: CAP; CDS_PART_NAME: CAP_0402-A36096-112,X7R,0.1UF,25V,10%,LPDB,GENERIC; CDS_LOCATION: C4M5
C4M6 = CAP: PART_NUMBER: A36096-112; CDS_PHYS_PART_NAME: CAP_0402-A36096-112,X7R,0.1UF,25V,10%,LPDB,GENERIC; OriginalSymbolOrigin: (-50,25); XY: (-4025,4225); VER: 1; ROT: 0; PHYS_PAGE: 95; LOCATION: C4M6; IP: GENERIC; FP_TECH: LPDB; DRAWING: @RVP1_ADL_SB_ADP_S_DDR5_SODIMM_2DPC_LIB.H55_DG2_2DPC(SCH_1):PAGE466; CDS_LIB: discrete; PCB Footprint: SMC0402IA; CHIPS_PART_NAME: CAP; CDS_PART_NAME: CAP_0402-A36096-112,X7R,0.1UF,25V,10%,LPDB,GENERIC; CDS_LOCATION: C4M6
C4M7 = CAP: PART_NUMBER: 602433-081; CDS_PHYS_PART_NAME: CAP_0603-602433-081,X5R,22UF,6.3V,20%,LPDB,GENERIC; OriginalSymbolOrigin: (-50,25); XY: (-4775,4700); VER: 1; ROT: 0; PHYS_PAGE: 95; LOCATION: C4M7; IP: GENERIC; FP_TECH: LPDB; DRAWING: @RVP1_ADL_SB_ADP_S_DDR5_SODIMM_2DPC_LIB.H55_DG2_2DPC(SCH_1):PAGE466; CDS_LIB: discrete; PCB Footprint: SMC0603ID; CHIPS_PART_NAME: CAP; CDS_PART_NAME: CAP_0603-602433-081,X5R,22UF,6.3V,20%,LPDB,GENERIC; CDS_LOCATION: C4M7
C4M8 = CAP: PART_NUMBER: A36096-114; CDS_PHYS_PART_NAME: CAP_0402-A36096-114,EMPTY,10UF,6.3V,20%,LPDB,GENERIC; OriginalSymbolOrigin: (-50,25); XY: (-2900,3600); VER: 1; ROT: 0; PHYS_PAGE: 95; LOCATION: C4M8; IP: GENERIC; FP_TECH: LPDB; DRAWING: @RVP1_ADL_SB_ADP_S_DDR5_SODIMM_2DPC_LIB.H55_DG2_2DPC(SCH_1):PAGE466; CDS_LIB: discrete; PCB Footprint: SMC0402IA; SEC_TYPE: 0402; CHIPS_PART_NAME: CAP; CDS_PART_NAME: CAP_0402-A36096-114,EMPTY,10UF,6.3V,20%,LPDB,GENERIC; CDS_LOCATION: C4M8
C4M9 = CAP: PART_NUMBER: A36096-112; CDS_PHYS_PART_NAME: CAP_0402-A36096-112,X7R,0.1UF,25V,10%,LPDB,GENERIC; OriginalSymbolOrigin: (-50,25); XY: (-2275,4700); VER: 1; ROT: 0; PHYS_PAGE: 95; LOCATION: C4M9; IP: GENERIC; FP_TECH: LPDB; DRAWING: @RVP1_ADL_SB_ADP_S_DDR5_SODIMM_2DPC_LIB.H55_DG2_2DPC(SCH_1):PAGE466; CDS_LIB: discrete; PCB Footprint: SMC0402IA; CHIPS_PART_NAME: CAP; CDS_PART_NAME: CAP_0402-A36096-112,X7R,0.1UF,25V,10%,LPDB,GENERIC; CDS_LOCATION: C4M9
C4M10 = CAP: PART_NUMBER: A36096-112; CDS_PHYS_PART_NAME: CAP_0402-A36096-112,X7R,0.1UF,25V,10%,LPDB,GENERIC; OriginalSymbolOrigin: (-50,25); XY: (-3275,4700); VER: 1; ROT: 0; PHYS_PAGE: 95; LOCATION: C4M10; IP: GENERIC; FP_TECH: LPDB; DRAWING: @RVP1_ADL_SB_ADP_S_DDR5_SODIMM_2DPC_LIB.H55_DG2_2DPC(SCH_1):PAGE466; CDS_LIB: discrete; PCB Footprint: SMC0402IA; CHIPS_PART_NAME: CAP; CDS_PART_NAME: CAP_0402-A36096-112,X7R,0.1UF,25V,10%,LPDB,GENERIC; CDS_LOCATION: C4M10
C4M11 = CAP: PART_NUMBER: A36096-112; CDS_PHYS_PART_NAME: CAP_0402-A36096-112,X7R,0.1UF,25V,10%,LPDB,GENERIC; OriginalSymbolOrigin: (-50,25); XY: (-2025,4700); VER: 1; ROT: 0; PHYS_PAGE: 95; LOCATION: C4M11; IP: GENERIC; FP_TECH: LPDB; DRAWING: @RVP1_ADL_SB_ADP_S_DDR5_SODIMM_2DPC_LIB.H55_DG2_2DPC(SCH_1):PAGE466; CDS_LIB: discrete; PCB Footprint: SMC0402IA; CHIPS_PART_NAME: CAP; CDS_PART_NAME: CAP_0402-A36096-112,X7R,0.1UF,25V,10%,LPDB,GENERIC; CDS_LOCATION: C4M11
C4M12 = CAP: PART_NUMBER: A36096-112; CDS_PHYS_PART_NAME: CAP_0402-A36096-112,X7R,0.1UF,25V,10%,LPDB,GENERIC; OriginalSymbolOrigin: (-50,25); XY: (-2525,4700); VER: 1; ROT: 0; PHYS_PAGE: 95; LOCATION: C4M12; IP: GENERIC; FP_TECH: LPDB; DRAWING: @RVP1_ADL_SB_ADP_S_DDR5_SODIMM_2DPC_LIB.H55_DG2_2DPC(SCH_1):PAGE466; CDS_LIB: discrete; PCB Footprint: SMC0402IA; CHIPS_PART_NAME: CAP; CDS_PART_NAME: CAP_0402-A36096-112,X7R,0.1UF,25V,10%,LPDB,GENERIC; CDS_LOCATION: C4M12
C4M13 = CAP: CDS_PHYS_PART_NAME: CAP_0402-A36096-121,X5R,2.2UF,10V,10%,LPDB,GENERIC; OriginalSymbolOrigin: (-50,25); XY: (-4375,1725); VER: 1; ROT: 2; PHYS_PAGE: 95; LOCATION: C4M13; IP: GENERIC; FP_TECH: LPDB; DRAWING: @RVP1_ADL_SB_ADP_S_DDR5_SODIMM_2DPC_LIB.H55_DG2_2DPC(SCH_1):PAGE466; CDS_LIB: discrete; PCB Footprint: SMC0402IA; CHIPS_PART_NAME: CAP; CDS_PART_NAME: CAP_0402-A36096-121,X5R,2.2UF,10V,10%,LPDB,GENERIC; CDS_LOCATION: C4M13
EU4B1 = FOXVILLE_IP: CDS_PHYS_PART_NAME: FOXVILLE_IP_QFN-J76978-002,IC,FOXVILLE_IP,1.1,LPDB,GENERIC; CDS_LMAN_SYM_OUTLINE: -500,1100,500,-1100; PACK_TYPE: QFN; OriginalSymbolOrigin: (-550,1100); XY: (-5575,3475); VER: 1; ROT: 0; PHYS_PAGE: 95; LOCATION: EU4B1; IP: GENERIC; FP_TECH: LPDB; DRAWING: @RVP1_ADL_SB_ADP_S_DDR5_SODIMM_2DPC_LIB.H55_DG2_2DPC(SCH_1):PAGE466; CDS_LIB: intel_inside; PCB Footprint: LCC56_S70_40DFS52MA; SEC_TYPE: QFN; CHIPS_PART_NAME: FOXVILLE_IP; CDS_PART_NAME: FOXVILLE_IP_QFN-J76978-002,IC,FOXVILLE_IP,1.1,LPDB,GENERIC; CDS_LOCATION: EU4B1
J9501 = HDR_2X4: CDS_PHYS_PART_NAME: HDR_2X4_SM-J97800-001,CON,HDR_2X4,LPDB,GENERIC; CDS_LMAN_SYM_OUTLINE: -100,150,100,-150; FP_TECH: LPDB; IP: GENERIC; PACK_TYPE: SM; OriginalSymbolOrigin: (-125,150); XY: (-2500,1250); VER: 1; ROT: 0; PHYS_PAGE: 95; LOCATION: J9501; DRAWING: @RVP1_ADL_SB_ADP_S_DDR5_SODIMM_2DPC_LIB.H55_DG2_2DPC(SCH_1):PAGE466; CDS_LIB: connector; PCB Footprint: HDR_SPV_2X4_127MA; CHIPS_PART_NAME: HDR_2X4; CDS_PART_NAME: HDR_2X4_SM-J97800-001,CON,HDR_2X4,LPDB,GENERIC; CDS_LOCATION: J9501
L4A4 = INDUCTOR: CDS_PHYS_PART_NAME: INDUCTOR_2016-H90826-001,INDUCTOR,1UH,20%,3.9A,LPDB,GENERIC; CDS_LMAN_SYM_OUTLINE: -75,25,75,-25; PACK_TYPE: 2016; OriginalSymbolOrigin: (-75,25); XY: (-4300,3775); VER: 1; ROT: 0; PHYS_PAGE: 95; LOCATION: L4A4; IP: GENERIC; FP_TECH: LPDB; DRAWING: @RVP1_ADL_SB_ADP_S_DDR5_SODIMM_2DPC_LIB.H55_DG2_2DPC(SCH_1):PAGE466; CDS_LIB: discrete; MATERIAL: INDUCTOR; PCB Footprint: SMI22X18MA; CHIPS_PART_NAME: INDUCTOR; CDS_PART_NAME: INDUCTOR_2016-H90826-001,INDUCTOR,1UH,20%,3.9A,LPDB,GENERIC; CDS_LOCATION: L4A4
Q4B1 = FET: CDS_PHYS_PART_NAME: FET_SM-C81974-001,IC,LPDB,GENERIC; CDS_LMAN_SYM_OUTLINE: -100,100,100,-100; PACK_TYPE: SM; OriginalSymbolOrigin: (-75,100); XY: (-8250,4600); VER: 2; PHYS_PAGE: 95; LOCATION: Q4B1; IP: GENERIC; FP_TECH: LPDB; DRAWING: @RVP1_ADL_SB_ADP_S_DDR5_SODIMM_2DPC_LIB.H55_DG2_2DPC(SCH_1):PAGE466; CDS_LIB: discrete; PCB Footprint: SOT23MA; ROT: 2; CHIPS_PART_NAME: FET; CDS_PART_NAME: FET_SM-C81974-001,IC,LPDB,GENERIC; CDS_LOCATION: Q4B1
R3B8 = RES: PART_NUMBER: A93548-023; CDS_PHYS_PART_NAME: RES_0402-A93548-023,EMPTY,1K,1%,1/16W,LPDB,GENERIC; WATTAGE: 1/16W; OriginalSymbolOrigin: (-25,75); XY: (-4750,775); VER: 2; ROT: 0; PHYS_PAGE: 95; LOCATION: R3B8; IP: GENERIC; FP_TECH: LPDB; DRAWING: @RVP1_ADL_SB_ADP_S_DDR5_SODIMM_2DPC_LIB.H55_DG2_2DPC(SCH_1):PAGE466; CDS_LIB: discrete; PCB Footprint: SMR0402IA; CHIPS_PART_NAME: RES; CDS_PART_NAME: RES_0402-A93548-023,EMPTY,1K,1%,1/16W,LPDB,GENERIC; CDS_LOCATION: R3B8
R4A36 = RES#1: PART_NUMBER: A93549-001; CHIPS_PART_NAME: RES; CDS_PHYS_PART_NAME: RES_0402-A93549-001,EMPTY,0,5%,1/16W,LPDB,GENERIC; WATTAGE: 1/16W; OriginalSymbolOrigin: (-75,25); XY: (-8250,4850); VER: 1; PHYS_PAGE: 95; LOCATION: R4A36; IP: GENERIC; FP_TECH: LPDB; FIN: LAN; DRAWING: @RVP1_ADL_SB_ADP_S_DDR5_SODIMM_2DPC_LIB.H55_DG2_2DPC(SCH_1):PAGE466; CDS_LIB: discrete; PCB Footprint: SMR0402IA; SEC_TYPE: 0402; ROT: 0; CDS_PART_NAME: RES_0402-A93549-001,EMPTY,0,5%,1/16W,LPDB,GENERIC; CDS_LOCATION: R4A36; BOM: LAN; ASI_MODEL: A93549-001
R4A45 = RES#1: CHIPS_PART_NAME: RES; CDS_PHYS_PART_NAME: RES_0402-A93548-034,CHIP,10K,1%,1/16W,LPDB,GENERIC; WATTAGE: 1/16W; OriginalSymbolOrigin: (-75,25); XY: (-7700,4975); VER: 1; ROT: 0; PHYS_PAGE: 95; LOCATION: R4A45; IP: GENERIC; FP_TECH: LPDB; FIN: LAN; DRAWING: @RVP1_ADL_SB_ADP_S_DDR5_SODIMM_2DPC_LIB.H55_DG2_2DPC(SCH_1):PAGE466; CDS_LIB: discrete; PCB Footprint: SMR0402IA; SEC_TYPE: 0402; CDS_PART_NAME: RES_0402-A93548-034,CHIP,10K,1%,1/16W,LPDB,GENERIC; CDS_LOCATION: R4A45; ASI_MODEL: A93548-034
R4A46 = RES#1: PART_NUMBER: A93548-034; CHIPS_PART_NAME: RES; CDS_PHYS_PART_NAME: RES_0402-A93548-034,CHIP,10K,1%,1/16W,LPDB,GENERIC; WATTAGE: 1/16W; OriginalSymbolOrigin: (-75,25); XY: (-8700,3075); VER: 1; ROT: 0; PHYS_PAGE: 95; LOCATION: R4A46; IP: GENERIC; FP_TECH: LPDB; DRAWING: @RVP1_ADL_SB_ADP_S_DDR5_SODIMM_2DPC_LIB.H55_DG2_2DPC(SCH_1):PAGE466; CDS_LIB: discrete; PCB Footprint: SMR0402IA; CDS_PART_NAME: RES_0402-A93548-034,CHIP,10K,1%,1/16W,LPDB,GENERIC; CDS_LOCATION: R4A46
R4A50 = RES#1: PART_NUMBER: A93548-045; CHIPS_PART_NAME: RES; CDS_PHYS_PART_NAME: RES_0402-A93548-045,EMPTY,49.9,1%,1/16W,LPDB,GENERIC; WATTAGE: 1/16W; OriginalSymbolOrigin: (-75,25); XY: (-6750,3625); VER: 1; ROT: 0; PHYS_PAGE: 95; LOCATION: R4A50; IP: GENERIC; FP_TECH: LPDB; DRAWING: @RVP1_ADL_SB_ADP_S_DDR5_SODIMM_2DPC_LIB.H55_DG2_2DPC(SCH_1):PAGE466; CDS_LIB: discrete; PCB Footprint: SMR0402IA; CDS_PART_NAME: RES_0402-A93548-045,EMPTY,49.9,1%,1/16W,LPDB,GENERIC; CDS_LOCATION: R4A50
R4A52 = RES#1: PART_NUMBER: A93548-034; CHIPS_PART_NAME: RES; CDS_PHYS_PART_NAME: RES_0402-A93548-034,CHIP,10K,1%,1/16W,LPDB,GENERIC; WATTAGE: 1/16W; OriginalSymbolOrigin: (-75,25); XY: (-6800,2775); VER: 1; ROT: 0; PHYS_PAGE: 95; LOCATION: R4A52; IP: GENERIC; FP_TECH: LPDB; FIN: LAN; DRAWING: @RVP1_ADL_SB_ADP_S_DDR5_SODIMM_2DPC_LIB.H55_DG2_2DPC(SCH_1):PAGE466; CDS_LIB: discrete; PCB Footprint: SMR0402IA; CDS_PART_NAME: RES_0402-A93548-034,CHIP,10K,1%,1/16W,LPDB,GENERIC; CDS_LOCATION: R4A52; ASI_MODEL: A93548-034
R4A53 = RES#1: PART_NUMBER: A93548-060; CHIPS_PART_NAME: RES; CDS_PHYS_PART_NAME: RES_0402-A93548-060,CHIP,200,1%,1/16W,LPDB,GENERIC; WATTAGE: 1/16W; OriginalSymbolOrigin: (-75,25); XY: (-6725,4075); VER: 1; ROT: 0; PHYS_PAGE: 95; LOCATION: R4A53; IP: GENERIC; FP_TECH: LPDB; DRAWING: @RVP1_ADL_SB_ADP_S_DDR5_SODIMM_2DPC_LIB.H55_DG2_2DPC(SCH_1):PAGE466; CDS_LIB: discrete; PCB Footprint: SMR0402IA; CDS_PART_NAME: RES_0402-A93548-060,CHIP,200,1%,1/16W,LPDB,GENERIC; CDS_LOCATION: R4A53
R4B3 = RES#1: CHIPS_PART_NAME: RES; CDS_PHYS_PART_NAME: RES_0402-A93548-639,CHIP,22K,1%,1/16W,LPDB,GENERIC; WATTAGE: 1/16W; OriginalSymbolOrigin: (-75,25); XY: (-6650,2525); VER: 1; ROT: 0; PHYS_PAGE: 95; LOCATION: R4B3; IP: GENERIC; FP_TECH: LPDB; DRAWING: @RVP1_ADL_SB_ADP_S_DDR5_SODIMM_2DPC_LIB.H55_DG2_2DPC(SCH_1):PAGE466; CDS_LIB: discrete; PCB Footprint: SMR0402IA; CDS_PART_NAME: RES_0402-A93548-639,CHIP,22K,1%,1/16W,LPDB,GENERIC; CDS_LOCATION: R4B3
R4B4 = RES#1: PART_NUMBER: A93549-001; CHIPS_PART_NAME: RES; CDS_PHYS_PART_NAME: RES_0402-A93549-001,CHIP,0,5%,1/16W,LPDB,GENERIC; WATTAGE: 1/16W; OriginalSymbolOrigin: (-75,25); XY: (-8125,2250); VER: 1; PHYS_PAGE: 95; LOCATION: R4B4; DRAWING: @RVP1_ADL_SB_ADP_S_DDR5_SODIMM_2DPC_LIB.H55_DG2_2DPC(SCH_1):PAGE466; CDS_LIB: discrete; PCB Footprint: SMR0402IA; ROT: 0; CDS_PART_NAME: RES_0402-A93549-001,CHIP,0,5%,1/16W,LPDB,GENERIC; CDS_LOCATION: R4B4
R4B8 = RES#1: CHIPS_PART_NAME: RES; CDS_PHYS_PART_NAME: RES_0402-A93548-034,CHIP,10K,1%,1/16W,LPDB,GENERIC; WATTAGE: 1/16W; OriginalSymbolOrigin: (-75,25); XY: (-7950,4375); VER: 1; ROT: 0; PHYS_PAGE: 95; LOCATION: R4B8; IP: GENERIC; FP_TECH: LPDB; FIN: LAN; DRAWING: @RVP1_ADL_SB_ADP_S_DDR5_SODIMM_2DPC_LIB.H55_DG2_2DPC(SCH_1):PAGE466; CDS_LIB: discrete; PCB Footprint: SMR0402IA; CDS_PART_NAME: RES_0402-A93548-034,CHIP,10K,1%,1/16W,LPDB,GENERIC; CDS_LOCATION: R4B8; ASI_MODEL: A93548-034
R4B11 = RES#1: CHIPS_PART_NAME: RES; CDS_PHYS_PART_NAME: RES_0402-A93548-517,CHIP,4.7K,1%,1/16W,LPDB,GENERIC; WATTAGE: 1/16W; OriginalSymbolOrigin: (-75,25); XY: (-8825,3750); VER: 1; ROT: 2; PHYS_PAGE: 95; LOCATION: R4B11; IP: GENERIC; FP_TECH: LPDB; DRAWING: @RVP1_ADL_SB_ADP_S_DDR5_SODIMM_2DPC_LIB.H55_DG2_2DPC(SCH_1):PAGE466; CDS_LIB: discrete; PCB Footprint: SMR0402IA; CDS_PART_NAME: RES_0402-A93548-517,CHIP,4.7K,1%,1/16W,LPDB,GENERIC; CDS_LOCATION: R4B11; ASI_MODEL: A93548-517
R4B12 = RES#1: PART_NUMBER: A93549-001; CHIPS_PART_NAME: RES; CDS_PHYS_PART_NAME: RES_0402-A93549-001,CHIP,0,5%,1/16W,LPDB,GENERIC; WATTAGE: 1/16W; OriginalSymbolOrigin: (-75,25); XY: (-8525,3650); VER: 1; PHYS_PAGE: 95; LOCATION: R4B12; IP: GENERIC; FP_TECH: LPDB; FIN: LAN; DRAWING: @RVP1_ADL_SB_ADP_S_DDR5_SODIMM_2DPC_LIB.H55_DG2_2DPC(SCH_1):PAGE466; CDS_LIB: discrete; PCB Footprint: SMR0402IA; ROT: 0; CDS_PART_NAME: RES_0402-A93549-001,CHIP,0,5%,1/16W,LPDB,GENERIC; CDS_LOCATION: R4B12; BOM: LAN; ASI_MODEL: A93549-001
R4B30 = RES: CDS_PHYS_PART_NAME: RES_0402-A93548-034,CHIP,10K,1%,1/16W,LPDB,GENERIC; WATTAGE: 1/16W; OriginalSymbolOrigin: (-25,75); XY: (-3725,2825); VER: 2; ROT: 0; PHYS_PAGE: 95; LOCATION: R4B30; IP: GENERIC; FP_TECH: LPDB; DRAWING: @RVP1_ADL_SB_ADP_S_DDR5_SODIMM_2DPC_LIB.H55_DG2_2DPC(SCH_1):PAGE466; CDS_LIB: discrete; PCB Footprint: SMR0402IA; CHIPS_PART_NAME: RES; CDS_PART_NAME: RES_0402-A93548-034,CHIP,10K,1%,1/16W,LPDB,GENERIC; CDS_LOCATION: R4B30
R4L10 = RES#1: PART_NUMBER: A93549-001; CHIPS_PART_NAME: RES; CDS_PHYS_PART_NAME: RES_0402-A93549-001,CHIP,0,5%,1/16W,LPDB,GENERIC; TOLERANCE: 5%; WATTAGE: 1/16W; OriginalSymbolOrigin: (-75,25); XY: (-2700,2850); VER: 1; PHYS_PAGE: 95; LOCATION: R4L10; IP: GENERIC; FP_TECH: LPDB; DRAWING: @RVP1_ADL_SB_ADP_S_DDR5_SODIMM_2DPC_LIB.H55_DG2_2DPC(SCH_1):PAGE466; CDS_LIB: discrete; PCB Footprint: SMR0402IA; SEC_TYPE: 0402; ROT: 0; CDS_PART_NAME: RES_0402-A93549-001,CHIP,0,5%,1/16W,LPDB,GENERIC; CDS_LOCATION: R4L10
R4L16 = RES#1: PART_NUMBER: A93549-001; CHIPS_PART_NAME: RES; CDS_PHYS_PART_NAME: RES_0402-A93549-001,CHIP,0,5%,1/16W,LPDB,GENERIC; TOLERANCE: 5%; WATTAGE: 1/16W; OriginalSymbolOrigin: (-75,25); XY: (-4225,3275); VER: 1; PHYS_PAGE: 95; LOCATION: R4L16; DRAWING: @RVP1_ADL_SB_ADP_S_DDR5_SODIMM_2DPC_LIB.H55_DG2_2DPC(SCH_1):PAGE466; CDS_LIB: discrete; PCB Footprint: SMR0402IA; SEC_TYPE: 0402; ROT: 0; CDS_PART_NAME: RES_0402-A93549-001,CHIP,0,5%,1/16W,LPDB,GENERIC; CDS_LOCATION: R4L16
R4M8 = RES#1: PART_NUMBER: A93548-034; CHIPS_PART_NAME: RES; CDS_PHYS_PART_NAME: RES_0402-A93548-034,CHIP,10K,1%,1/16W,LPDB,GENERIC; WATTAGE: 1/16W; OriginalSymbolOrigin: (-75,25); XY: (-6050,1275); VER: 1; ROT: 0; PHYS_PAGE: 95; LOCATION: R4M8; IP: GENERIC; FP_TECH: LPDB; DRAWING: @RVP1_ADL_SB_ADP_S_DDR5_SODIMM_2DPC_LIB.H55_DG2_2DPC(SCH_1):PAGE466; CDS_LIB: discrete; PCB Footprint: SMR0402IA; CDS_PART_NAME: RES_0402-A93548-034,CHIP,10K,1%,1/16W,LPDB,GENERIC; CDS_LOCATION: R4M8
R4M9 = RES#1: PART_NUMBER: A93549-001; CHIPS_PART_NAME: RES; CDS_PHYS_PART_NAME: RES_0402-A93549-001,CHIP,0,5%,1/16W,LPDB,GENERIC; TOLERANCE: 5%; WATTAGE: 1/16W; OriginalSymbolOrigin: (-75,25); XY: (-4225,3025); VER: 1; PHYS_PAGE: 95; LOCATION: R4M9; DRAWING: @RVP1_ADL_SB_ADP_S_DDR5_SODIMM_2DPC_LIB.H55_DG2_2DPC(SCH_1):PAGE466; CDS_LIB: discrete; PCB Footprint: SMR0402IA; ROT: 0; CDS_PART_NAME: RES_0402-A93549-001,CHIP,0,5%,1/16W,LPDB,GENERIC; CDS_LOCATION: R4M9
R4M11 = RES#1: PART_NUMBER: A93548-034; CHIPS_PART_NAME: RES; CDS_PHYS_PART_NAME: RES_0402-A93548-034,CHIP,10K,1%,1/16W,LPDB,GENERIC; WATTAGE: 1/16W; OriginalSymbolOrigin: (-75,25); XY: (-6050,1525); VER: 1; ROT: 0; PHYS_PAGE: 95; LOCATION: R4M11; IP: GENERIC; FP_TECH: LPDB; DRAWING: @RVP1_ADL_SB_ADP_S_DDR5_SODIMM_2DPC_LIB.H55_DG2_2DPC(SCH_1):PAGE466; CDS_LIB: discrete; PCB Footprint: SMR0402IA; CDS_PART_NAME: RES_0402-A93548-034,CHIP,10K,1%,1/16W,LPDB,GENERIC; CDS_LOCATION: R4M11
R4M12 = RES#1: PART_NUMBER: A93548-034; CHIPS_PART_NAME: RES; CDS_PHYS_PART_NAME: RES_0402-A93548-034,CHIP,10K,1%,1/16W,LPDB,GENERIC; WATTAGE: 1/16W; OriginalSymbolOrigin: (-75,25); XY: (-6050,1150); VER: 1; ROT: 0; PHYS_PAGE: 95; LOCATION: R4M12; IP: GENERIC; FP_TECH: LPDB; DRAWING: @RVP1_ADL_SB_ADP_S_DDR5_SODIMM_2DPC_LIB.H55_DG2_2DPC(SCH_1):PAGE466; CDS_LIB: discrete; PCB Footprint: SMR0402IA; CDS_PART_NAME: RES_0402-A93548-034,CHIP,10K,1%,1/16W,LPDB,GENERIC; CDS_LOCATION: R4M12
R4M14 = RES#1: PART_NUMBER: A93548-034; CHIPS_PART_NAME: RES; CDS_PHYS_PART_NAME: RES_0402-A93548-034,CHIP,10K,1%,1/16W,LPDB,GENERIC; WATTAGE: 1/16W; OriginalSymbolOrigin: (-75,25); XY: (-6050,1650); VER: 1; ROT: 0; PHYS_PAGE: 95; LOCATION: R4M14; IP: GENERIC; FP_TECH: LPDB; DRAWING: @RVP1_ADL_SB_ADP_S_DDR5_SODIMM_2DPC_LIB.H55_DG2_2DPC(SCH_1):PAGE466; CDS_LIB: discrete; PCB Footprint: SMR0402IA; CDS_PART_NAME: RES_0402-A93548-034,CHIP,10K,1%,1/16W,LPDB,GENERIC; CDS_LOCATION: R4M14
R4M15 = RES#1: PART_NUMBER: A93549-001; CHIPS_PART_NAME: RES; CDS_PHYS_PART_NAME: RES_0402-A93549-001,CHIP,0,5%,1/16W,LPDB,GENERIC; TOLERANCE: 5%; WATTAGE: 1/16W; OriginalSymbolOrigin: (-75,25); XY: (-4225,3175); VER: 1; PHYS_PAGE: 95; LOCATION: R4M15; DRAWING: @RVP1_ADL_SB_ADP_S_DDR5_SODIMM_2DPC_LIB.H55_DG2_2DPC(SCH_1):PAGE466; CDS_LIB: discrete; PCB Footprint: SMR0402IA; ROT: 0; CDS_PART_NAME: RES_0402-A93549-001,CHIP,0,5%,1/16W,LPDB,GENERIC; CDS_LOCATION: R4M15
R4M16 = RES#1: PART_NUMBER: A93548-034; CHIPS_PART_NAME: RES; CDS_PHYS_PART_NAME: RES_0402-A93548-034,EMPTY,10K,1%,1/16W,LPDB,GENERIC; WATTAGE: 1/16W; OriginalSymbolOrigin: (-75,25); XY: (-6050,975); VER: 1; ROT: 0; PHYS_PAGE: 95; LOCATION: R4M16; IP: GENERIC; FP_TECH: LPDB; DRAWING: @RVP1_ADL_SB_ADP_S_DDR5_SODIMM_2DPC_LIB.H55_DG2_2DPC(SCH_1):PAGE466; CDS_LIB: discrete; PCB Footprint: SMR0402IA; SEC_TYPE: 0402; CDS_PART_NAME: RES_0402-A93548-034,EMPTY,10K,1%,1/16W,LPDB,GENERIC; CDS_LOCATION: R4M16
R4M17 = RES#1: PART_NUMBER: A93549-001; CHIPS_PART_NAME: RES; CDS_PHYS_PART_NAME: RES_0402-A93549-001,CHIP,0,5%,1/16W,LPDB,GENERIC; TOLERANCE: 5%; WATTAGE: 1/16W; OriginalSymbolOrigin: (-75,25); XY: (-4225,3075); VER: 1; PHYS_PAGE: 95; LOCATION: R4M17; DRAWING: @RVP1_ADL_SB_ADP_S_DDR5_SODIMM_2DPC_LIB.H55_DG2_2DPC(SCH_1):PAGE466; CDS_LIB: discrete; PCB Footprint: SMR0402IA; ROT: 0; CDS_PART_NAME: RES_0402-A93549-001,CHIP,0,5%,1/16W,LPDB,GENERIC; CDS_LOCATION: R4M17
R4M18 = RES#1: PART_NUMBER: A93549-001; CHIPS_PART_NAME: RES; CDS_PHYS_PART_NAME: RES_0402-A93549-001,CHIP,0,5%,1/16W,LPDB,GENERIC; TOLERANCE: 5%; WATTAGE: 1/16W; OriginalSymbolOrigin: (-75,25); XY: (-4225,3125); VER: 1; PHYS_PAGE: 95; LOCATION: R4M18; DRAWING: @RVP1_ADL_SB_ADP_S_DDR5_SODIMM_2DPC_LIB.H55_DG2_2DPC(SCH_1):PAGE466; CDS_LIB: discrete; PCB Footprint: SMR0402IA; ROT: 0; CDS_PART_NAME: RES_0402-A93549-001,CHIP,0,5%,1/16W,LPDB,GENERIC; CDS_LOCATION: R4M18
R4M19 = RES#1: PART_NUMBER: A93548-034; CHIPS_PART_NAME: RES; CDS_PHYS_PART_NAME: RES_0402-A93548-034,CHIP,10K,1%,1/16W,LPDB,GENERIC; WATTAGE: 1/16W; OriginalSymbolOrigin: (-75,25); XY: (-6050,1400); VER: 1; ROT: 0; PHYS_PAGE: 95; LOCATION: R4M19; IP: GENERIC; FP_TECH: LPDB; DRAWING: @RVP1_ADL_SB_ADP_S_DDR5_SODIMM_2DPC_LIB.H55_DG2_2DPC(SCH_1):PAGE466; CDS_LIB: discrete; PCB Footprint: SMR0402IA; CDS_PART_NAME: RES_0402-A93548-034,CHIP,10K,1%,1/16W,LPDB,GENERIC; CDS_LOCATION: R4M19
U4B1 = W25Q16: CDS_PHYS_PART_NAME: W25Q16_SOIC-J45555-001,IC,W25Q16JVSSIQ,LPDB,GENERIC; PACK_TYPE: SOIC; OriginalSymbolOrigin: (-350,250); XY: (-3800,1375); VER: 1; ROT: 0; PHYS_PAGE: 95; LOCATION: U4B1; IP: GENERIC; FP_TECH: LPDB; DRAWING: @RVP1_ADL_SB_ADP_S_DDR5_SODIMM_2DPC_LIB.H55_DG2_2DPC(SCH_1):PAGE466; CDS_LIB: memory; PCB Footprint: SOI8_S52_127MB; SEC_TYPE: SOIC; CHIPS_PART_NAME: W25Q16; CDS_PART_NAME: W25Q16_SOIC-J45555-001,IC,W25Q16JVSSIQ,LPDB,GENERIC; CDS_LOCATION: U4B1
Y4B1 = XTAL_4P_C: CDS_PHYS_PART_NAME: XTAL_4P_C_SM-D71700-057,XTAL,25MHZ,0.003%,LPDB,GENERIC; CDS_LMAN_SYM_OUTLINE: -100,150,100,-150; PACK_TYPE: SM; OriginalSymbolOrigin: (-125,150); XY: (-8150,2000); VER: 1; ROT: 0; PHYS_PAGE: 95; LOCATION: Y4B1; DRAWING: @RVP1_ADL_SB_ADP_S_DDR5_SODIMM_2DPC_LIB.H55_DG2_2DPC(SCH_1):PAGE466; CDS_LIB: discrete; PCB Footprint: SMY4_32X25MA; SEC_TYPE: SM; CHIPS_PART_NAME: XTAL_4P_C; CDS_PART_NAME: XTAL_4P_C_SM-D71700-057,XTAL,25MHZ,0.003%,LPDB,GENERIC; CDS_LOCATION: Y4B1